# Altium project Soldering station finalise.PrjPcb
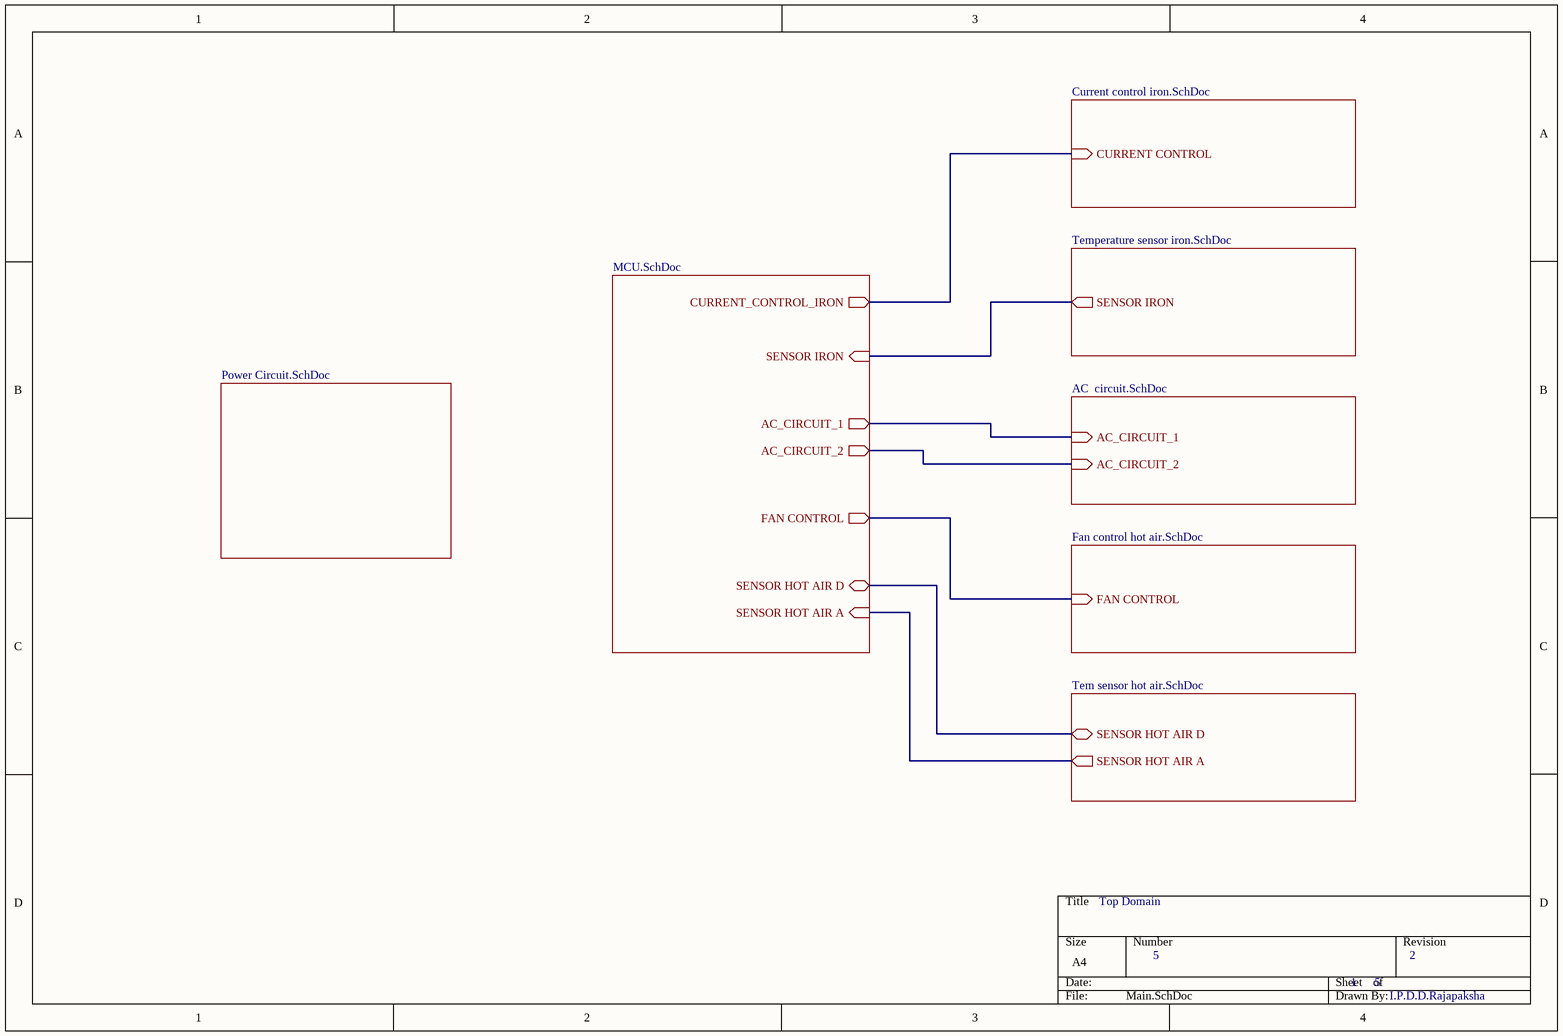
[diagram p0: Main.SchDoc]
8 sheets, 60 parts. Net scope: hierarchical (ports join the sheet entries above them; power ports are global).
Board file: DC_PCB.PcbDoc
Sheets:
  Main.SchDoc
    MCU = MCU.SchDoc
    Power Circuit = Power Circuit.SchDoc
    Current control iron = Current control iron.SchDoc
    Temperature sensor = Temperature sensor iron.SchDoc
    AC circuit = AC  circuit.SchDoc
    Fan control hot air = Fan control hot air.SchDoc
    Tem sensor hot air = Tem sensor hot air.SchDoc

## Sheet Main.SchDoc
size A4; SheetNumber: 1; SheetTotal: 8

### Sub-sheets
AC circuit = AC  circuit.SchDoc: AC_CIRCUIT_1 (in), AC_CIRCUIT_2 (in)
Current control iron = Current control iron.SchDoc: CURRENT CONTROL (in)
Fan control hot air = Fan control hot air.SchDoc: FAN CONTROL (in)
MCU = MCU.SchDoc: CURRENT_CONTROL_IRON (out), SENSOR IRON (in), FAN CONTROL (out), SENSOR HOT AIR A (in), SENSOR HOT AIR D (bidir), AC_CIRCUIT_1 (out), AC_CIRCUIT_2 (out)
Power Circuit = Power Circuit.SchDoc: no entries
Tem sensor hot air = Tem sensor hot air.SchDoc: SENSOR HOT AIR D (bidir), SENSOR HOT AIR A (out)
Temperature sensor = Temperature sensor iron.SchDoc: SENSOR IRON (out)

### Nets
NetC10_1: sheet MCU/SENSOR HOT AIR D, sheet Tem sensor hot air/SENSOR HOT AIR D
NetIC2_1: sheet MCU/SENSOR IRON, sheet Temperature sensor/SENSOR IRON
NetJ12_1: sheet MCU/AC_CIRCUIT_1, sheet AC circuit/AC_CIRCUIT_1
NetR2_2: sheet MCU/CURRENT_CONTROL_IRON, sheet Current control iron/CURRENT CONTROL
NetR8_1: sheet MCU/AC_CIRCUIT_2, sheet AC circuit/AC_CIRCUIT_2
NetR9_1: sheet MCU/FAN CONTROL, sheet Fan control hot air/FAN CONTROL
NetR15_1: sheet MCU/SENSOR HOT AIR A, sheet Tem sensor hot air/SENSOR HOT AIR A

### Notes on the sheet
- Top Domain
- 5
- 1      5
- 2
- I.P.D.D.Rajapaksha

## Sheet MCU.SchDoc
size A4; SheetNumber: 2; SheetTotal: 8
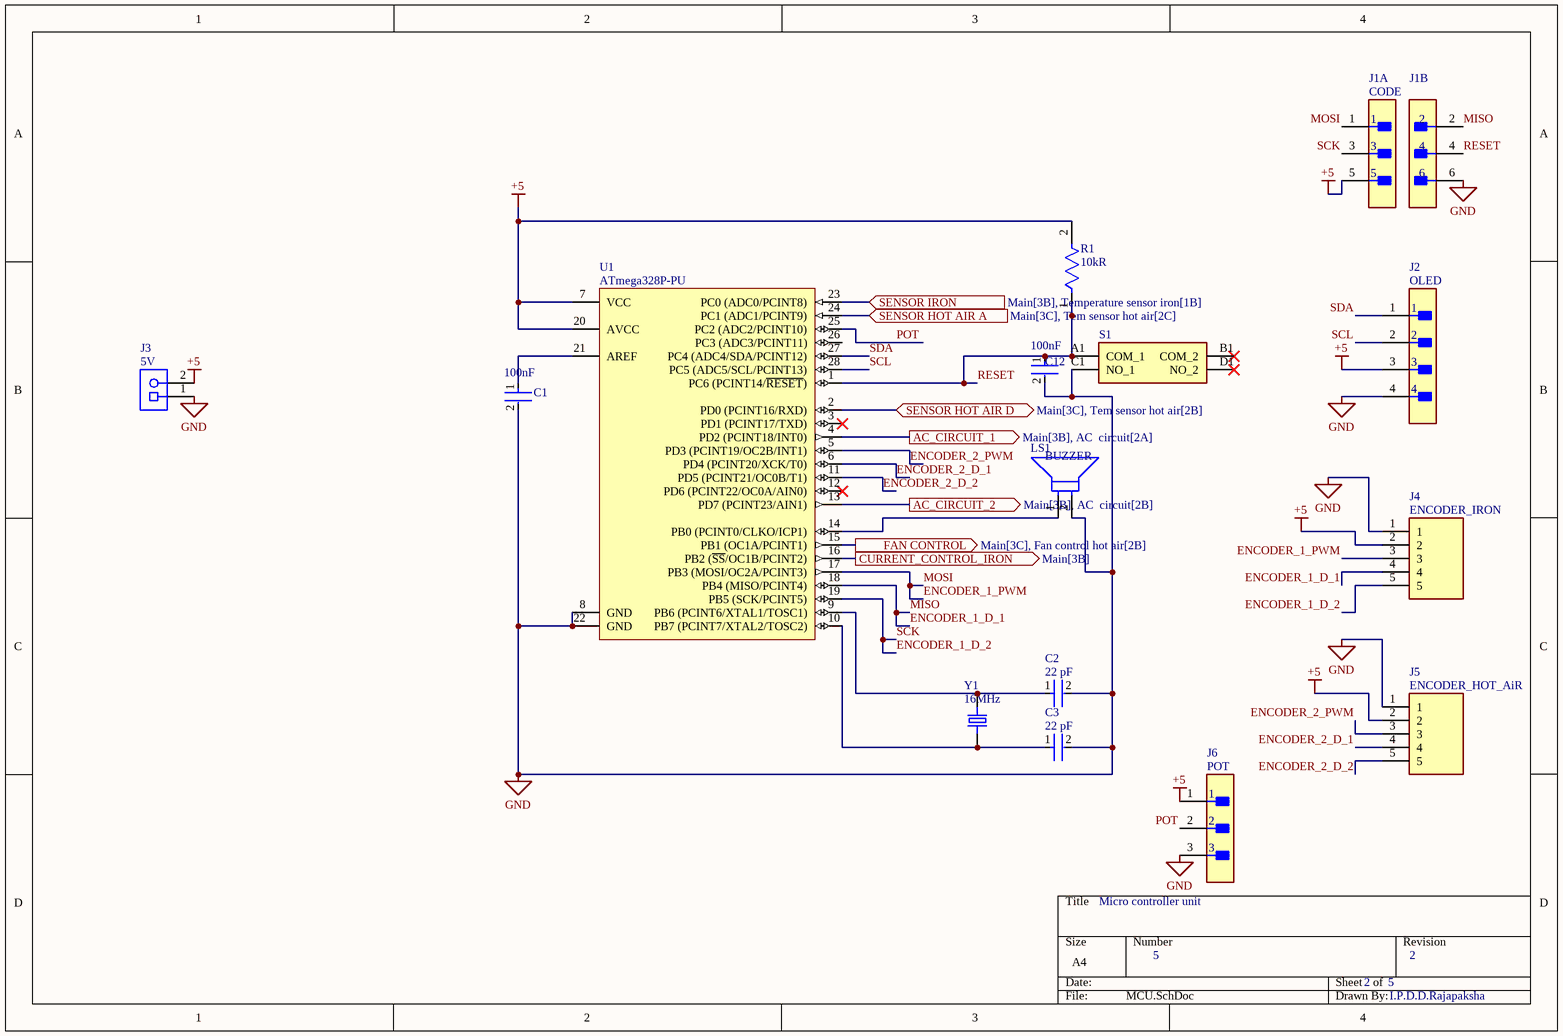
[diagram p1: MCU.SchDoc]

### Parts
C1  Capacitance: 100nF  [FP-0805-L_2_01_0_2-W_1_25-IPC_A]  (hidden comment: 0805YC104M4T2A)
C2  Capacitance: 22 pF  [FP-C0805C-DN-MFG]  (hidden comment: C0805C220J5GACTU)
C3  Capacitance: 22 pF  [FP-C0805C-DN-MFG]  (hidden comment: C0805C220J5GACTU)
C12  Capacitance: 100nF  [FP-0805-L_2_01_0_2-W_1_25-IPC_A]  (hidden comment: 0805YC104M4T2A)
J1  Parameter 1: CODE  [FP-90131-0763-MFG]  (hidden comment: 90131-0763)  (parts A,B of 2)
J2  value OLED  [FP-B4B-XH-A_LF_SN-MFG]  (hidden comment: B4B-XH-A(LF)(SN))
J3  Parameter 1: 5V  [PHOE-1729128-2_V]  (hidden comment: 1729128)
J4  Parameter 1: ENCODER_IRON  [B5BXHAMLFSN]  (hidden comment: B5B-XH-AM__LF__SN_)
J5  Parameter 1: ENCODER_HOT_AiR  [B5BXHAMLFSN]  (hidden comment: B5B-XH-AM__LF__SN_)
J6  Parameter 1: POT  [FP-B3B-XH-A_LF_SN-MFG]  (hidden comment: B3B-XH-A(LF)(SN))
LS1  Parameter 1: BUZZER  [FP-AI-1223-TWT-5V-R-MFG]  (hidden comment: AI-1223-TWT-5V-R)
R1  Resistance: 10kR  [FP-CRCW1206-e3-IPC_C]  (hidden comment: CRCW120610K0FKEA)
S1  TS-1187A-B-A-B  [TS1187ABAB]  (value not drawn)
U1  ATmega328P-PU  [28P3]
Y1  value 16MHz  [XTAL_ECS-160-20-4X]  (hidden comment: ECS-160-S-4)

### Ports
AC_CIRCUIT_1 (out, see Main[3B], AC  circuit[2A]), AC_CIRCUIT_2 (out, see Main[3B], AC  circuit[2B]), CURRENT_CONTROL_IRON (out, see Main[3B]), FAN CONTROL (out, see Main[3C], Fan control hot air[2B]), SENSOR HOT AIR A (in, see Main[3C], Tem sensor hot air[2C]), SENSOR HOT AIR D (bidir, see Main[3C], Tem sensor hot air[2B]), SENSOR IRON (in, see Main[3B], Temperature sensor iron[1B])

### Nets
+5: J1.5 J2.3 J3.2 J4.2 J5.2 J6.1 R1.2 U1.7(VCC) U1.20(AVCC)
GND: C1.2 C2.2 C3.2 C12.2 J1.6 J2.4 J3.1 J4.1 J5.1 J6.3 LS1.2(A) S1.C1(NO_1) U1.8(GND) U1.22(GND)  [project net negative]
ENCODER_1_D_1: J1.2 J4.4 U1.18(PB4_(MISO/PCINT4))  [also labelled MISO]
ENCODER_1_D_2: J1.3 J4.5 U1.19(PB5_(SCK/PCINT5))  [also labelled SCK]
ENCODER_1_PWM: J1.1 J4.3 U1.17(PB3_(MOSI/OC2A/PCINT3))  [also labelled MOSI]
ENCODER_2_D_1: J5.4 U1.6(PD4_(PCINT20/XCK/T0))
ENCODER_2_D_2: J5.5 U1.11(PD5_(PCINT21/OC0B/T1))
ENCODER_2_PWM: J5.3 U1.5(PD3_(PCINT19/OC2B/INT1))
POT: J6.2 U1.25(PC2_(ADC2/PCINT10))
RESET: C12.1 J1.4 R1.1 S1.A1(COM_1) U1.1(PC6_(PCINT14/~{RESET}))
SCL: J2.2 U1.28(PC5_(ADC5/SCL/PCINT13))
SDA: J2.1 U1.27(PC4_(ADC4/SDA/PCINT12))
NetC1_1: C1.1 U1.21(AREF)
NetC2_1: C2.1 U1.9(PB6_(PCINT6/XTAL1/TOSC1)) Y1.2
NetC3_1: C3.1 U1.10(PB7_(PCINT7/XTAL2/TOSC2)) Y1.1
NetC10_1: U1.2(PD0_(PCINT16/RXD)) ; port SENSOR HOT AIR D
NetIC2_1: U1.23(PC0_(ADC0/PCINT8)) ; port SENSOR IRON
NetJ12_1: U1.4(PD2_(PCINT18/INT0)) ; port AC_CIRCUIT_1
NetLS1_1: LS1.1(C) U1.14(PB0_(PCINT0/CLKO/ICP1))
NetR2_2: U1.16(PB2_(~{SS}/OC1B/PCINT2)) ; port CURRENT_CONTROL_IRON
NetR8_1: U1.13(PD7_(PCINT23/AIN1)) ; port AC_CIRCUIT_2
NetR9_1: U1.15(PB1_(OC1A/PCINT1)) ; port FAN CONTROL
NetR15_1: U1.24(PC1_(ADC1/PCINT9)) ; port SENSOR HOT AIR A

Not connected (* = marked no-connect by the designer): S1 B1(COM_2)* D1(NO_2)*; U1 3(PD1_(PCINT17/TXD))* 12(PD6_(PCINT22/OC0A/AIN0))* 26(PC3_(ADC3/PCINT11))

### Notes on the sheet
- (near J6) Micro controller unit
- 5
- 2      5
- 2
- I.P.D.D.Rajapaksha

### Library data of the parts
C1 C12 = CMP-04427-015812-1: Automotive Ceramic Capacitor, 0805, 100nF, 20%, X7R, 0.15, 16V; Termination: SMD/SMT; Case Code (Metric): 2012; Length: 0.079inch; Dielectric: X7R; Max Operating Temperature: 125°C; Thickness: 0.037inch; Ratings: AEC-Q200; Package Quantity: 4000; Weight: 0.000194oz; Voltage Rating: 16V; Voltage Rating (DC): 16V; Mount: Surface Mount; Width: 1.25mm; Packaging: Tape and Reel; Tolerance: 20%; Case/Package: 0805; Height: 0.94mm; Case Code (Imperial): 0805; Min Operating Temperature: -55°C
C2 C3 = CMP-2007-00048-2: Capacitor; Ceramic; Cap; 22.0pF; Tol 5%; SMT; Vol-Rtg 50V; C0G; Tape and Reel; Manufacturer: KEMET; Temperature Coefficient: 30ppm/°C; Value: 22 pF; Tolerance: 0.05; Device Class L1: Passive Components; Mouser Description: Multilayer Ceramic Capacitors MLCC - SMD/SMT 50volts 22pF C0G 5%; Temperature Range Low: -55°C; Automotive: No; Voltage Rating: 50 V; Material: Ceramic; Category: Cap; Height: 0.88mm; Temperature Range High: +125°C; Digikey Description: Capacitor; Ceramic; Cap; 22.0pF; Tol 5%; SMT; Vol-Rtg 50V; C0G; Tape and Reel; Octopart: https://octopart.com/c0805c220j5gactu-kemet-145470; ComponentLink2Description: Datasheet; Device Class L2: Capacitors; Ipc Land Pattern Name: CAPC200125X78; RoHS: TRUE; ComponentLink2URL: https://content.kemet.com/datasheets/KEM_C1003_C0G_SMD.pdf; Temperature: -55°C to +125°C; Device Class L3: Ceramic Capacitors; Lead Free: Yes; Manufacturer Part Number: C0805C220J5GACTU; Temperature Characteristic: C0G; Package: C0805C-DN
J1 = CMP-00257-00655468-1: 90131-0763 Conn Unshrouded Header HDR 6 POS 2.54mm Solder ST Top Entry Thru-Hole C-Grid III™ Tray; NexarPartId: 655468; Manufacturer Lifecycle Status: ACTIVE; Number of Poles: 6; Plating: Tin; Current Rating: 3A; Gender: Male; Voltage Rating (AC): 350V; Contact Resistance: 20mΩ; Insulation Resistance: 5GΩ; Pitch: 2.54mm; Height: 9.65mm; Mount: Through Hole; Termination: Through Hole; Contact Plating: Gold; Orientation: Vertical; Material: Glass, Polyester; Min Operating Temperature: -55°C; Lead Free: Lead Free; REACH SVHC: Unknown; Contact Material: Brass; Housing Color: Black; Schedule B: 8536694040; Number of Rows: 2; Lead Pitch: 2.54mm; Number of Circuits: 6; Number of Positions: 6; Lifecycle Status: Production; Max Operating Temperature: 125°C; Voltage Rating: 350V; Voltage Rating (DC): 350V; Country of Origin: SG; Housing Material: Polyester; RoHS: Compliant; Working Voltage: 350V; Number of Contacts: 6; Radiation Hardening: No
J2 = CMP-17439-000250-1: CONN HEADER VERT 4POS 2.5MM; Number of Contacts: 4; Contact Resistance: 20mR; Voltage Rating: 250V; Max Current Rating: 3A; Gender: Male; Wire/Cable Gauge: 22AWG; Mated Stacking Heights: 9.8mm; Insulation Resistance: 1GR; Orientation: Straight; Contact Type: Male Pin; Contact Finish - Mating: TIN; Series: XH; Max Voltage Rating (AC): 250V; Lead Pitch: 2.5mm; Contact Shape: Square; Insulation Color: Natural; Termination: Solder; Lead Free: Lead Free; Voltage Rating (AC): 250V; Number of Rows: 1; Flammability Rating: UL94 V-0; Number of Positions: 4; Max Operating Temperature: 85°C; Package Quantity: 500; Mount: Through Hole; REACH SVHC: No SVHC; Connector Type: Header; Insulation Material: Nylon; Fastening Type: Detent; Min Operating Temperature: -25°C; Housing Color: White; Packaging: Bulk; Contact Plating: Tin; Contact Material: Brass; Max Voltage Rating (DC): 250V; Housing Material: Polyamide; Color: Natural; Material: Polyamide; Pitch: 2.5mm; Depth: 5.75mm; Current Rating: 3A; Length: 12.4mm
J3 = CMP-2000-05815-1: PCB Terminal Block, 13.5 A, 400 V, 2-Pin THD, RoHS, Bulk; Manufacturer: Phoenix Contact; Package Version: 03/2015; No. of Rows: 1; Pitch: 5.08mm; No. of Positions: 2; Voltage Rating: 400V; Current Rating: 13500mA; Manufacturer URL: http://www.phoenixcontact.com/; Datasheet URL: https://datasheet.ciiva.com/16046/1729128-16046181.pdf; RoHS: TRUE; Package URL: https://www.phoenixcontact.com/online/portal/pi/pxc/product_detail_page/!ut/p/b1/3VdJjqNKFDxLH8AFycySyWY2ozFsEPOMMQaDOX1XedGL_1Vdm5YXJleknhSKeBkvI6EA8ncAo3AYoDhBQGco6KN7VURTdemj9us_IEKEZo_YHiPAEWEFmDGOHMORkqKYCORBZxgL7ZoaZYcbFFUZ3fqxSY6GOuxydWUuHqz1ynmMFygu583Bob0Ewr6Sd_l-5m-kAueHiB0jpRwZwe58wwtkpxtMYd_LmGcDRU02dRNEyWt6Y2ti5pSyJ_reIkzIulrqApdnbT11V5jnCKbYNCvhEM1MCpPByat_X379-iThf08CI5GfOPqfBeS3BRoBOdD55AKVv0iLwCMq-2BrzXWSGRH7pUGD9uwXQjiph3xL0DKQwdGa0JImiIOmBNOestqgwTHSSs2oOep-78apyXQBvNi8ZLaFjvjWvcaUEBu0MC6Wbe-d6mB0FAebo2lUWinqYaZs5DAYzV0RP9yitUjnGJ0iI9xhZkT42OCQNUJJhkgWINNQLP2JFP6OpMg3JCVg70jqHT0lvKOnhHf0lPuOnnLf0VPuWx6_dxwUIvwk5WMkT0kLL1mh61l2yZVSzG3pYV_bqo-mj6uMKwKwdnnW8Jh5RTOJzMOA5c-eJDaZQw4mTMPH02PvS_ZAqNVjVTo2WyYLkwH_KU1mmmG5kjRhDqPXLwwVHvVOjCM60-fpXvTDfMGW1PVFVS1r4e4yVDk4ZdNbkUHvqPqQSeian4UD39fNKmachqdJ1NJbyk8rXT9mXTvPk3oE5meulKGgiruPJek-4I9hTT6G8ZLOyRSm2RRVbThERQad5OS28hdt4YW4vG0stgYYzsWsK4_7y6DZMjJSCqri1kyiZR5vD7pwIrNR7QwPHTcLTI5qT7eRlpHrdGiupYlqQDJ7zy_CND8fWWBoLRXxk1RVcXiBQwbTD4Xi7KL-FuO94t9xaqweXzH; PartNumber: 1729128; Package Description: 2-Pin Through Hole Device, Body 8.1 x 10.16 mm, Pitch 5.08 mm; Datasheet Version: 12/2013; Mounting Technology: ThroughHole; Orientation: Horizontal; Package Reference: 1729128-2; Packing: Bulk
J4 J5 = B5B-XH-AM__LF__SN_: Connector; Manufacturer_Name: JST (JAPAN SOLDERLESS TERMINALS); Manufacturer_Part_Number: B5B-XH-AM (LF)(SN); Datasheet Link: http://uk.rs-online.com/web/p/products/1755317; Height: 7mm; Arrow Part Number: B5B-XH-AM (LF)(SN); Arrow Price/Stock: https://www.arrow.com/en/products/b5b-xh-am-lf-sn/jst-manufacturing
J6 = CMP-17439-000014-3: CONN HEADER VERT 3POS 2.5MM; Max Voltage Rating (DC): 250V; Number of Positions: 3; Current Rating: 3A; Gender: Male; Wire/Cable Gauge: 22AWG; Contact Resistance: 20mR; Insulation Resistance: 1GR; Insulation Material: Nylon; Contact Plating: Tin; Depth: 5.75mm; Contact Type: Male Pin; Max Operating Temperature: 85°C; Insulation Color: Natural; Voltage Rating (AC): 250V; Color: Natural; Connector Type: Header; Orientation: Straight; Fastening Type: Detent; Housing Color: White; Min Operating Temperature: -25°C; Termination: Solder; Voltage Rating: 250V; Series: XH; Pitch: 2.5mm; Contact Shape: Square; Number of Rows: 1; Lead Free: Lead Free; Packaging: Bulk; Mount: Through Hole; Flammability Rating: UL94 V-0; Max Voltage Rating (AC): 250V; REACH SVHC: No SVHC; Housing Material: Polyamide; Contact Material: Brass; Lead Pitch: 2.5mm; Contact Finish - Mating: TIN; Length: 9.9mm; Max Current Rating: 3A; Number of Contacts: 3
LS1 = CMP-231724-000001-1: AUDIO MAGNETIC INDICATOR 3-7V TH; Input Type: DC; Bandwidth: 2.3kHz; Nominal Supply Voltage (DC): 5V; Max Supply Current: 30mA; Washable: Yes; Max Supply Voltage (DC): 7V; Min Supply Voltage: 3V; Series: AI; Width: 12mm; REACH SVHC: No SVHC; Contact Plating: Tin; Frequency: 2.3kHz; Operating Supply Current: 30mA; Weight: 0.01lb; Current Rating: 30mA; Mount: Through Hole; Packaging: Tray; Length: 12mm; Lead Free: Lead Free; Color: Black; Input Current: 30mA; Min Operating Temperature: -40°C; Self Resonant Frequency: 2.3kHz; Sensing Method: Magnetic; Voltage Rating (DC): 5V; Height: 9.5mm; Termination: PC Pins; Min Supply Voltage (DC): 3V; Package Quantity: 100; Max Supply Voltage: 7V; Diameter: 12mm; Max Operating Temperature: 85°C
R1 = CMP-2003-04807-2: RES Thick Film, 10kΩ, 1%, 0.25W, 100ppm/°C, 1206; Working Voltage: 200V; Max Power Dissipation: 250mW; Tolerance: 1%; Width: 0.063inch; Height: 0.55mm; Number of Pins: 2; Voltage Rating: 200V; Temperature Coefficient: 100ppm/°C; Military Standard: Not; Features: Automotive AEC-Q200; Depth: 1.6mm; Radiation Hardening: No; Termination: SMD/SMT; Case Code (Imperial): 1206; Weight: 0.000353oz; Length: 3.2mm; Package Quantity: 10; Voltage Rating (DC): 200V; Case/Package: 1206; Min Operating Temperature: -55°C; Number of Terminations: 2; Composition: Thick Film; Contact Plating: Tin; Power Rating: 250mW; Packaging: Tape and Reel; Max Operating Temperature: 155°C; Lead Free: Lead Free; Case Code (Metric): 3216
S1 = TS-1187A-B-A-B: Switch; Manufacturer_Name: XKB Connectivity; Datasheet Link: http://www.helloxkb.com/public/images/pdf/TS-1187A-X-X-X.pdf; Height: 4.05mm; Manufacturer_Part_Number: TS-1187A-B-A-B
U1 = CMP-0095-00013-2: 8-bit AVR Microcontroller, 32KB Flash, 1KB EEPROM, 2KB SRAM, 28-pin PDIP, Industrial Grade (-40°C to 85°C); RevisionNote: DatasheetVersion updated. URLs added.; PackageVersion: revB, Sep-2001; PackageDescription: 28-lead (0.300"/7.62mm Wide) Plastic Dual Inline Package (PDIP); DatasheetVersion: revD, May-2011; ComponentLink1Description: Manufacturer URL; ComponentLink1URL: http://www.atmel.com/; PackageReference: 28P3; ComponentLink2Description: ATmega48A/48PA/88A/88PA/168A/168PA/328/328P Datasheet; ComponentLink3URL: http://www.atmel.com/dyn/resources/prod_documents/8271S.pdf; ComponentLink2URL: http://www.atmel.com/dyn/resources/prod_documents/8271.pdf; ComponentLink3Description: ATmega48A/48PA/88A/88PA/168A/168PA/328/328P Summary
Y1 = ECS-160-S-4: 16MHz Â±30ppm Crystal Series 40 Ohms HC-49/US; MF: ECS Inc.; SnapEDA_Link: https://www.snapeda.com/parts/ECS-160-S-4/ECS%20Inc./view-part/3657575/?ref=snap; Availability: Unavailable; Price: None; MP: ECS-160-S-4; Package: HC49/US ECS International

## Sheet Power Circuit.SchDoc
size A4; SheetNumber: 3; SheetTotal: 8
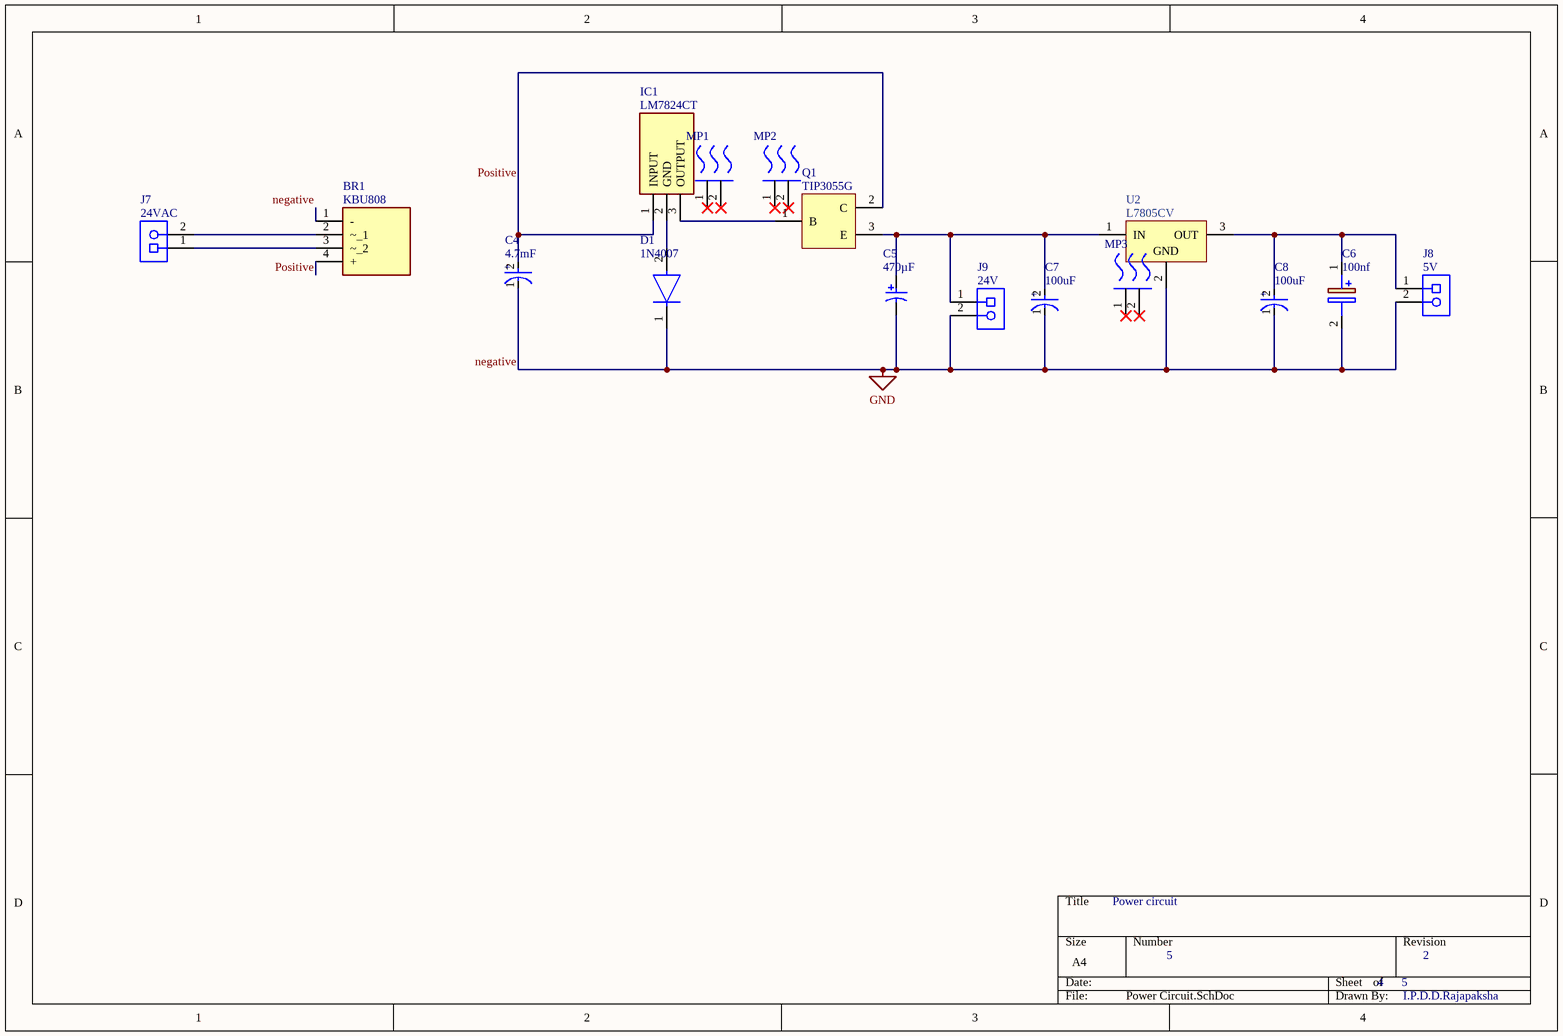
[diagram p2: Power Circuit.SchDoc]

### Parts
BR1  KBU808  [KBU808]
C4  Capacitance: 4.7mF  [FP-RAD-TH-D_18_0_5-L_35_5-MFG]  (hidden comment: ECA1VHG472)
C5  Capacitance: 470µF  [PNSC-CAP-10x20-P2]  (hidden comment: ECA-1HHG471)
C6  Parameter 1: 100nf  [CAPPRD150W50D400H600]  (hidden comment: ECEA1HKS0R1)
C7  Capacitance: 100uF  [FP-EEU-FR1H101B-MFG]  (hidden comment: EEU-FR1H101B)
C8  Capacitance: 100uF  [FP-EEU-FR1H101B-MFG]  (hidden comment: EEU-FR1H101B)
D1  1N4007  [FP-1N4007-MFG]
IC1  LM7824CT  [TO254P470X1028X1955-3P]
J7  Parameter 1: 24VAC  [PHOE-1729128-2_V]  (hidden comment: 1729128)
J8  Parameter 1: 5V  [PHOE-1729128-2_V]  (hidden comment: 1729128)
J9  Parameter 1: 24V  [PHOE-1729128-2_V]  (hidden comment: 1729128)
MP1  WV-T264-101E  [FP-WV-T264-101E-MFG]  (value not drawn)
MP2  WV-T264-101E  [FP-WV-T264-101E-MFG]  (value not drawn)
MP3  WV-T264-101E  [FP-WV-T264-101E-MFG]  (value not drawn)
Q1  TIP3055G  [ONSC-TO-247-3-340L-02]
U2  L7805CV  [TO220]

### Nets
negative: BR1.1(-) C4.1(C) C5.2 C6.2(-) C7.1(C) C8.1(C) D1.1(C) J8.2 J9.2 U2.2(GND)  [also labelled GND]
Positive: BR1.4(+) C4.2(A) IC1.1(INPUT) Q1.2(C)
NetBR1_2: BR1.2(~_1) J7.2
NetBR1_3: BR1.3(~_2) J7.1
NetC5_1: C5.1 C7.2(A) J9.1 Q1.3(E) U2.1(IN)
NetC6_1: C6.1(+) C8.2(A) J8.1 U2.3(OUT)
NetD1_2: D1.2(A) IC1.2(GND)
NetIC1_3: IC1.3(OUTPUT) Q1.1(B)

Not connected (* = marked no-connect by the designer): MP1 1(MNT_1)* 2(MNT_2)*; MP2 1(MNT_1)* 2(MNT_2)*; MP3 1(MNT_1)* 2(MNT_2)*

### Notes on the sheet
- Power circuit
- 5
- 4      5
- 2
- I.P.D.D.Rajapaksha
- (in symbol CMP-05427-000020-1) +
- (in symbol CMP-05427-001627-1) +

### Library data of the parts
BR1 = KBU808: Bridge Rectifier; Manufacturer_Name: MDD; Datasheet Link: https://datasheet.lcsc.com/szlcsc/MDD-Jiangsu-Yutai-Elec-KBU808_C3087.pdf; Height: 19.8mm; Manufacturer_Part_Number: KBU808
C4 = CMP-05427-001627-1: Aluminum Electrolytic Capacitors (Radial Lead Type) AEC-Q200 Qualified 4700uF ±20% 35V; Leakage Current: 3uA; Life (Hours): 2000Hour; Lead Diameter: 0.8mm; Dissipation Factor: 0.2%; Lead/Base Style: Straight; Ripple Current: 1.91A; Packaging: Bulk; RoHS Compliant: Yes; Number of Pins: 2; Radiation Hardening: No; Features: General Purpose; Mount: Through Hole; Voltage Rating (DC): 35V; Construction: RADIAL; Min Operating Temperature: -55°C; Voltage Rating: 35V; Contact Plating: Tin; Height - Seated (Max): 1.398inch; Termination: Radial; Series: NHG; Lead Pitch: 7.5mm; Diameter: 18mm; Voltage: 35V; Package Quantity: 50; Height: 35.5mm; Max Operating Temperature: 105°C; REACH SVHC: No SVHC; Length: 35.5mm; Case/Package: Radial; Tolerance: 20%; Ripple Current (AC): 1.91A
C5 = CMP-2000-05308-1: Aluminum Electrolytic Capacitor, 470 uF, +/- 20%, 50 V, -55 to 105 degC, 2-Pin THD, RoHS, Bulk; Manufacturer: Panasonic; Package Version: Nov-12; Type: Radial; Lifetime@Temperature: 2000Hrs@105degC; Rated Voltage: 50V; Ripple Current: 530mA; Case Size/Dimension: Ø10x20mm; Package Reference: CAP-10x20-P2; Package Description: 2-Pin Through Hole Device, Dia 10 mm, Body Length 20 mm, Pin Spacing 5 mm; Series: NHG; Datasheet Version: Nov-12; Datasheet URL: http://www.alliedelec.com/images/products/datasheets/bm/Panasonic/70067776.pdf; Package URL: http://www.alliedelec.com/images/products/datasheets/bm/Panasonic/70067776.pdf; Operating Temp-Max: 105degC; Operating Temp Range: -55to+105degC; Manufacturer URL: http://www.panasonic.com/
C6 = ECEA1HKS0R1: Capacitor Polarised; Manufacturer_Name: Panasonic; Datasheet Link: https://componentsearchengine.com/Datasheets/2/ECEA1HKS0R1.pdf; Height: 6mm; Manufacturer_Part_Number: ECEA1HKS0R1
C7 C8 = CMP-05427-000020-1: CAP ALUM 100UF 20% 50V RADIAL; Life (Hours): 6000Hour; Ripple Current: 870mA; Lead Diameter: 0.6mm; Impedance: 61mR; Tolerance: 20%; Mount: Through Hole; Lead Free: Lead Free; Length: 11.5mm; Height - Seated (Max): 0.512inch; Contact Plating: Tin; Termination: Radial; Series: FR; Max Operating Temperature: 105°C; Features: General Purpose; Min Operating Temperature: -40°C; RoHS Compliant: Yes; Height: 11.5mm; Voltage Rating (DC): 50V; Diameter: 8mm; Lead Pitch: 5mm; Radiation Hardening: No; Package Quantity: 1; Case/Package: Radial; Voltage Rating: 50V; Packaging: Tape and Reel; ESR (Equivalent Series Resistance): 61mR; REACH SVHC: No SVHC
D1 = CMP-123542-000001-1: Rectifier diode 1000 V 1 A DO-41, ,; Manufacturer: Diotec; Max Surge Forward Current: 27A; Forward Current: 1A; Max Junction Temp: +175°C; Reverse Voltage: 1000V; Value: 15pF; Peak Reverse Current: 5uA; Category: Diode; Temperature Range Low: -50°C; Automotive: No; Temperature: -50°C to +175°C; Lead Free: Yes; ComponentLink2Description: Datasheet; Max Repetitive Reverse Voltage: 1000V; ComponentLink2URL: https://datasheet.octopart.com/1N4007-Diotec-datasheet-62346875.pdf; Manufacturer Part Number: 1N4007; Device Class L3: Rectifier Diodes; Height: 2.8mm; Octopart: https://octopart.com/1n4007-diotec-4040411; Package: 1N4007; Temperature Range High: +175°C; Device Class L1: Discrete Semiconductors; Device Class L2: Diodes; RoHS: TRUE; Capacitance: 15pF; Ipc Land Pattern Name: DIOAD888W100L520D280
IC1 = LM7824CT: Integrated Circuit; Manufacturer_Name: Texas Instruments; Datasheet Link: https://media.digikey.com/pdf/Data%20Sheets/National%20Semiconductor%20PDFs/LM140,LM340(A).LM7800C.pdf; Height: 4.7mm; Manufacturer_Part_Number: LM7824CT; Mouser Part Number: N/A; Mouser Price/Stock: https://www.mouser.co.uk/ProductDetail/Texas-Instruments/LM7824CT?qs=9V2QonpqdTsSUSVcEBRo9w%3D%3D
J7-J9 = CMP-2000-05815-1: as J3 on sheet MCU; Manufacturer URL: http://www.phoenixcontact.com/; Datasheet URL: https://datasheet.ciiva.com/16046/1729128-16046181.pdf; RoHS: TRUE; Package URL: https://www.phoenixcontact.com/online/portal/pi/pxc/product_detail_page/!ut/p/b1/3VdJjqNKFDxLH8AFycySyWY2ozFsEPOMMQaDOX1XedGL_1Vdm5YXJleknhSKeBkvI6EA8ncAo3AYoDhBQGco6KN7VURTdemj9us_IEKEZo_YHiPAEWEFmDGOHMORkqKYCORBZxgL7ZoaZYcbFFUZ3fqxSY6GOuxydWUuHqz1ynmMFygu583Bob0Ewr6Sd_l-5m-kAueHiB0jpRwZwe58wwtkpxtMYd_LmGcDRU02dRNEyWt6Y2ti5pSyJ_reIkzIulrqApdnbT11V5jnCKbYNCvhEM1MCpPByat_X379-iThf08CI5GfOPqfBeS3BRoBOdD55AKVv0iLwCMq-2BrzXWSGRH7pUGD9uwXQjiph3xL0DKQwdGa0JImiIOmBNOestqgwTHSSs2oOep-78apyXQBvNi8ZLaFjvjWvcaUEBu0MC6Wbe-d6mB0FAebo2lUWinqYaZs5DAYzV0RP9yitUjnGJ0iI9xhZkT42OCQNUJJhkgWINNQLP2JFP6OpMg3JCVg70jqHT0lvKOnhHf0lPuOnnLf0VPuWx6_dxwUIvwk5WMkT0kLL1mh61l2yZVSzG3pYV_bqo-mj6uMKwKwdnnW8Jh5RTOJzMOA5c-eJDaZQw4mTMPH02PvS_ZAqNVjVTo2WyYLkwH_KU1mmmG5kjRhDqPXLwwVHvVOjCM60-fpXvTDfMGW1PVFVS1r4e4yVDk4ZdNbkUHvqPqQSeian4UD39fNKmachqdJ1NJbyk8rXT9mXTvPk3oE5meulKGgiruPJek-4I9hTT6G8ZLOyRSm2RRVbThERQad5OS28hdt4YW4vG0stgYYzsWsK4_7y6DZMjJSCqri1kyiZR5vD7pwIrNR7QwPHTcLTI5qT7eRlpHrdGiupYlqQDJ7zy_CND8fWWBoLRXxk1RVcXiBQwbTD4Xi7KL-FuO94t9xaqweXzH; PartNumber: 1729128; Package Description: 2-Pin Through Hole Device, Body 8.1 x 10.16 mm, Pitch 5.08 mm; Datasheet Version: 12/2013; Mounting Technology: ThroughHole; Orientation: Horizontal; Package Reference: 1729128-2; Packing: Bulk
MP1-MP3 = CMP-33535-000032-1: HEATSINK W/CLIP FOR TO-264; Natural Thermal Resistance: 12°C/W; Shape: Fins; Thermal Resistance @ Forced Air Flow (100 LFM): 8°C/W; Width: 23.4mm; Weight: 0.42oz; Package Quantity: 10; RoHS Compliant: Yes; Mount: Clip; Package Cooled: TO-264; Height Off Base: 0.63inch; Height: 32mm; Packaging: Bulk; Series: W; Case/Package: TO-264; Length: 1.26inch; Material: Aluminium
Q1 = CMP-1048-01314-1: Complementary Silicon Power Transistor, 3-Pin TO-247, Pb-Free, Tube; Manufacturer: On Semiconductor; Polarity: NPN; fT Min (MHz): 2.5; IC Continuous (A): 15; ComponentLink3URL: http://www.onsemi.cn/pub_link/Collateral/340L-02.PDF; ComponentLink3Description: Package Specification; RoHS: TRUE; PackageDescription: 3-Pin Flange Mount, Vertical Straight Lead, Body 16.005 x 5 mm, Pitch 5.45 mm; PackageVersion: Rev. F, 10/2011; ComponentLink1Description: Manufacturer URL; PackageReference: TO-247-3-340L-02; DatasheetVersion: Rev. 7; ComponentLink2Description: Datasheet; Packing: Tube; Mounting Technology: Through Hole; ComponentLink1URL: http://www.onsemi.com/; ComponentLink2URL: http://www.onsemi.com/pub_link/Collateral/TIP3055-D.PDF; PartNumber: TIP3055G
U2 = CMP-0244-00483-1: Positive Voltage Regulator, 5V, 3-Pin TO-220; PackageDescription: TO, Thru-Hole, Vertical, Heatsink Mounted; 3 In-Line Leads; Pitch 2.54 mm; ComponentLink2Description: Datasheet; PackageReference: TO220; ComponentLink3URL: http://www.st.com/internet/com/TECHNICAL_RESOURCES/TECHNICAL_LITERATURE/PACKAGE_INFORMATION/CD00004649.pdf; DatasheetVersion: 16/11/2011; ComponentLink1Description: Manufacturer URL; ComponentLink1URL: http://www.st.com; PackageVersion: ver3.0; ComponentLink3Description: Package Specification; ComponentLink2URL: http://www.st.com/internet/com/TECHNICAL_RESOURCES/TECHNICAL_LITERATURE/DATASHEET/CD00000444.pdf

## Sheet Current control iron.SchDoc
size A4; SheetNumber: 4; SheetTotal: 8
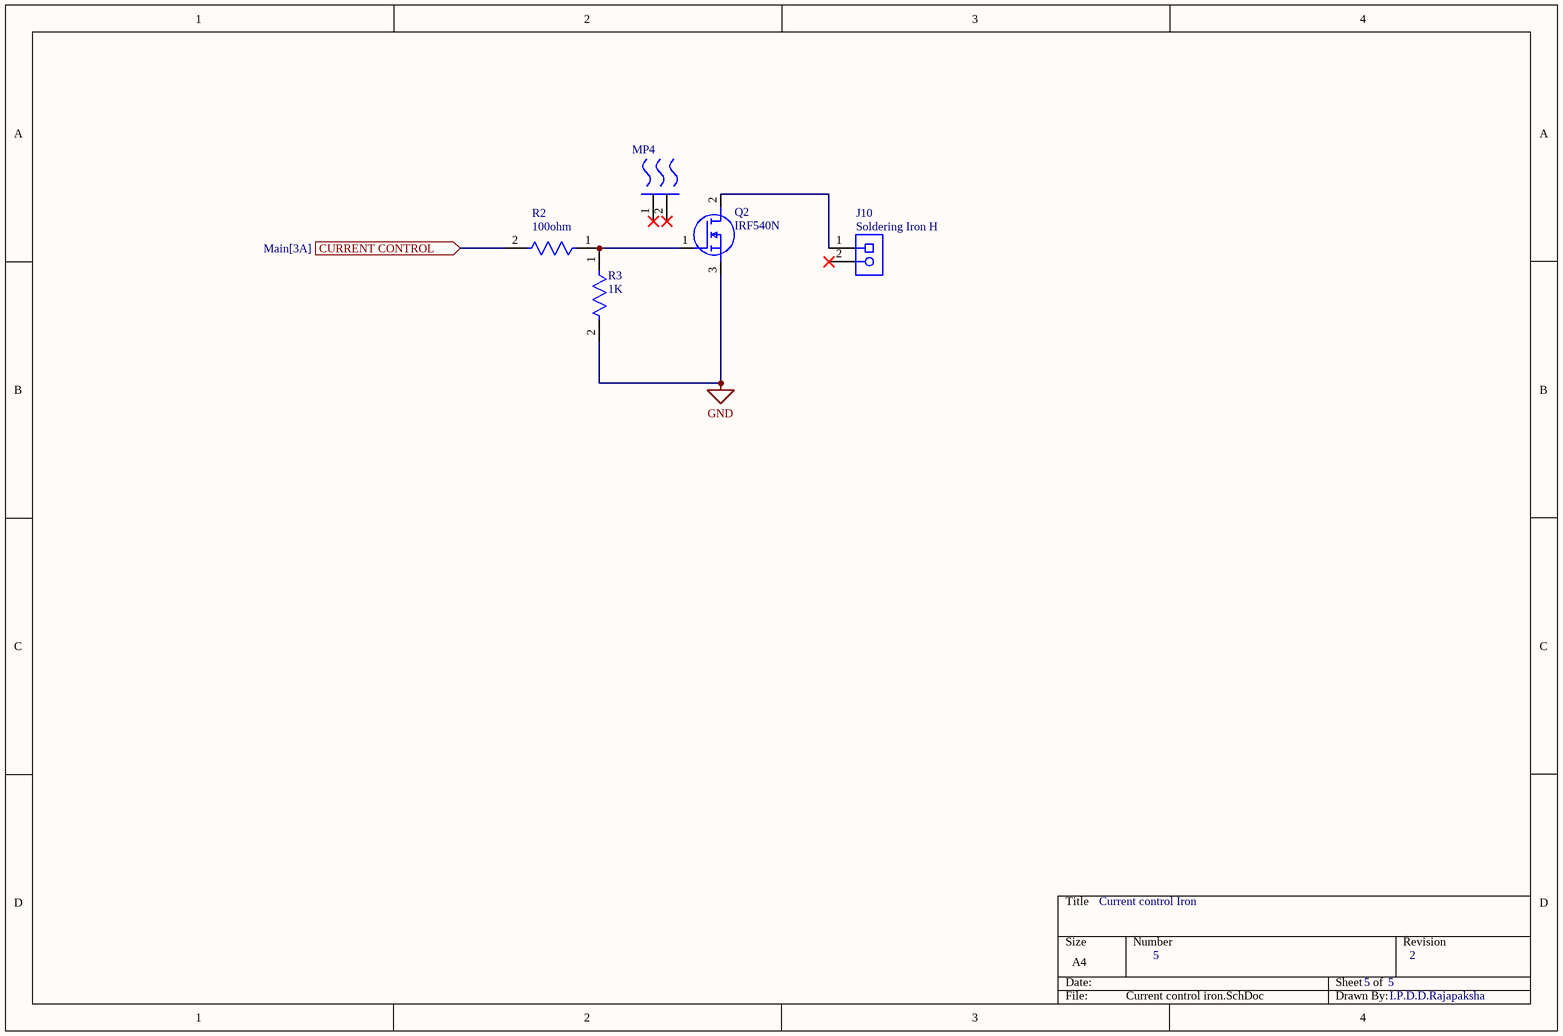
[diagram p3: Current control iron.SchDoc]

### Parts
J10  Parameter 1: Soldering Iron H  [PHOE-1729128-2_V]  (hidden comment: 1729128)
MP4  WV-T264-101E  [FP-WV-T264-101E-MFG]  (value not drawn)
Q2  IRF540N  [TO254P469X1042X1967-3P]
R2  value 100ohm  [FP-CMF50-0]  (hidden comment: CMF5073K200FHEB)
R3  value 1K  [FP-CMF50-0]  (hidden comment: CMF5073K200FHEB)

### Ports
CURRENT CONTROL (in, see Main[3A])

### Nets
GND: Q2.3(S) R3.2  [project net negative]
NetJ10_1: J10.1 Q2.2(D)
NetQ2_1: Q2.1(G) R2.1 R3.1
NetR2_2: R2.2 ; port CURRENT CONTROL

Not connected (* = marked no-connect by the designer): J10 2*; MP4 1(MNT_1)* 2(MNT_2)*

### Notes on the sheet
- Current control Iron
- 5
- 5      5
- 2
- I.P.D.D.Rajapaksha

### Library data of the parts
J10 = CMP-2000-05815-1: as J3 on sheet MCU; Manufacturer URL: http://www.phoenixcontact.com/; Datasheet URL: https://datasheet.ciiva.com/16046/1729128-16046181.pdf; RoHS: TRUE; Package URL: https://www.phoenixcontact.com/online/portal/pi/pxc/product_detail_page/!ut/p/b1/3VdJjqNKFDxLH8AFycySyWY2ozFsEPOMMQaDOX1XedGL_1Vdm5YXJleknhSKeBkvI6EA8ncAo3AYoDhBQGco6KN7VURTdemj9us_IEKEZo_YHiPAEWEFmDGOHMORkqKYCORBZxgL7ZoaZYcbFFUZ3fqxSY6GOuxydWUuHqz1ynmMFygu583Bob0Ewr6Sd_l-5m-kAueHiB0jpRwZwe58wwtkpxtMYd_LmGcDRU02dRNEyWt6Y2ti5pSyJ_reIkzIulrqApdnbT11V5jnCKbYNCvhEM1MCpPByat_X379-iThf08CI5GfOPqfBeS3BRoBOdD55AKVv0iLwCMq-2BrzXWSGRH7pUGD9uwXQjiph3xL0DKQwdGa0JImiIOmBNOestqgwTHSSs2oOep-78apyXQBvNi8ZLaFjvjWvcaUEBu0MC6Wbe-d6mB0FAebo2lUWinqYaZs5DAYzV0RP9yitUjnGJ0iI9xhZkT42OCQNUJJhkgWINNQLP2JFP6OpMg3JCVg70jqHT0lvKOnhHf0lPuOnnLf0VPuWx6_dxwUIvwk5WMkT0kLL1mh61l2yZVSzG3pYV_bqo-mj6uMKwKwdnnW8Jh5RTOJzMOA5c-eJDaZQw4mTMPH02PvS_ZAqNVjVTo2WyYLkwH_KU1mmmG5kjRhDqPXLwwVHvVOjCM60-fpXvTDfMGW1PVFVS1r4e4yVDk4ZdNbkUHvqPqQSeian4UD39fNKmachqdJ1NJbyk8rXT9mXTvPk3oE5meulKGgiruPJek-4I9hTT6G8ZLOyRSm2RRVbThERQad5OS28hdt4YW4vG0stgYYzsWsK4_7y6DZMjJSCqri1kyiZR5vD7pwIrNR7QwPHTcLTI5qT7eRlpHrdGiupYlqQDJ7zy_CND8fWWBoLRXxk1RVcXiBQwbTD4Xi7KL-FuO94t9xaqweXzH; PartNumber: 1729128; Package Description: 2-Pin Through Hole Device, Body 8.1 x 10.16 mm, Pitch 5.08 mm; Datasheet Version: 12/2013; Mounting Technology: ThroughHole; Orientation: Horizontal; Package Reference: 1729128-2; Packing: Bulk
MP4 = CMP-33535-000032-1: as MP1 on sheet Power Circuit; Width: 23.4mm; Weight: 0.42oz; Package Quantity: 10; RoHS Compliant: Yes; Mount: Clip; Package Cooled: TO-264; Height Off Base: 0.63inch; Height: 32mm; Packaging: Bulk; Series: W; Case/Package: TO-264; Length: 1.26inch; Material: Aluminium
Q2 = IRF540N: MOSFET (N-Channel); Manufacturer_Name: Infineon; Datasheet Link: http://uk.rs-online.com/web/p/products/3713068; Height: 4.69mm; Manufacturer_Part_Number: IRF540N
R2 R3 = CMP-00030-44386654-1: CMF5073K200FHEB Res Metal Film 73.2K Ohm 1% 0.125W(1/8W) ±50ppm/°C Epoxy AXL T/R; Max Power Dissipation: 250mW; Voltage Rating: 200V; Power Rating: 125mW; Resistance: 73.2kΩ; Tolerance: 1%; Width: 1.65mm; Length: 3.81mm; Schedule B: 8533210090, 8533210090; Termination: Axial; Lead Free: Lead Free; Diameter: 1.65mm; Voltage Rating (DC): 200V; NexarPartId: 44386654; Packaging: Cut Tape; Max Operating Temperature: 175°C; Composition: Metal Film; RoHS: Compliant; Mount: Through Hole; Features: Flame Retardant Coating, Moisture Resistant; Number of Terminations: 2; Temperature Coefficient: 50ppm/°C; Min Operating Temperature: -55°C; Case/Package: Axial

## Sheet Temperature sensor iron.SchDoc
size A4; SheetNumber: 5; SheetTotal: 8
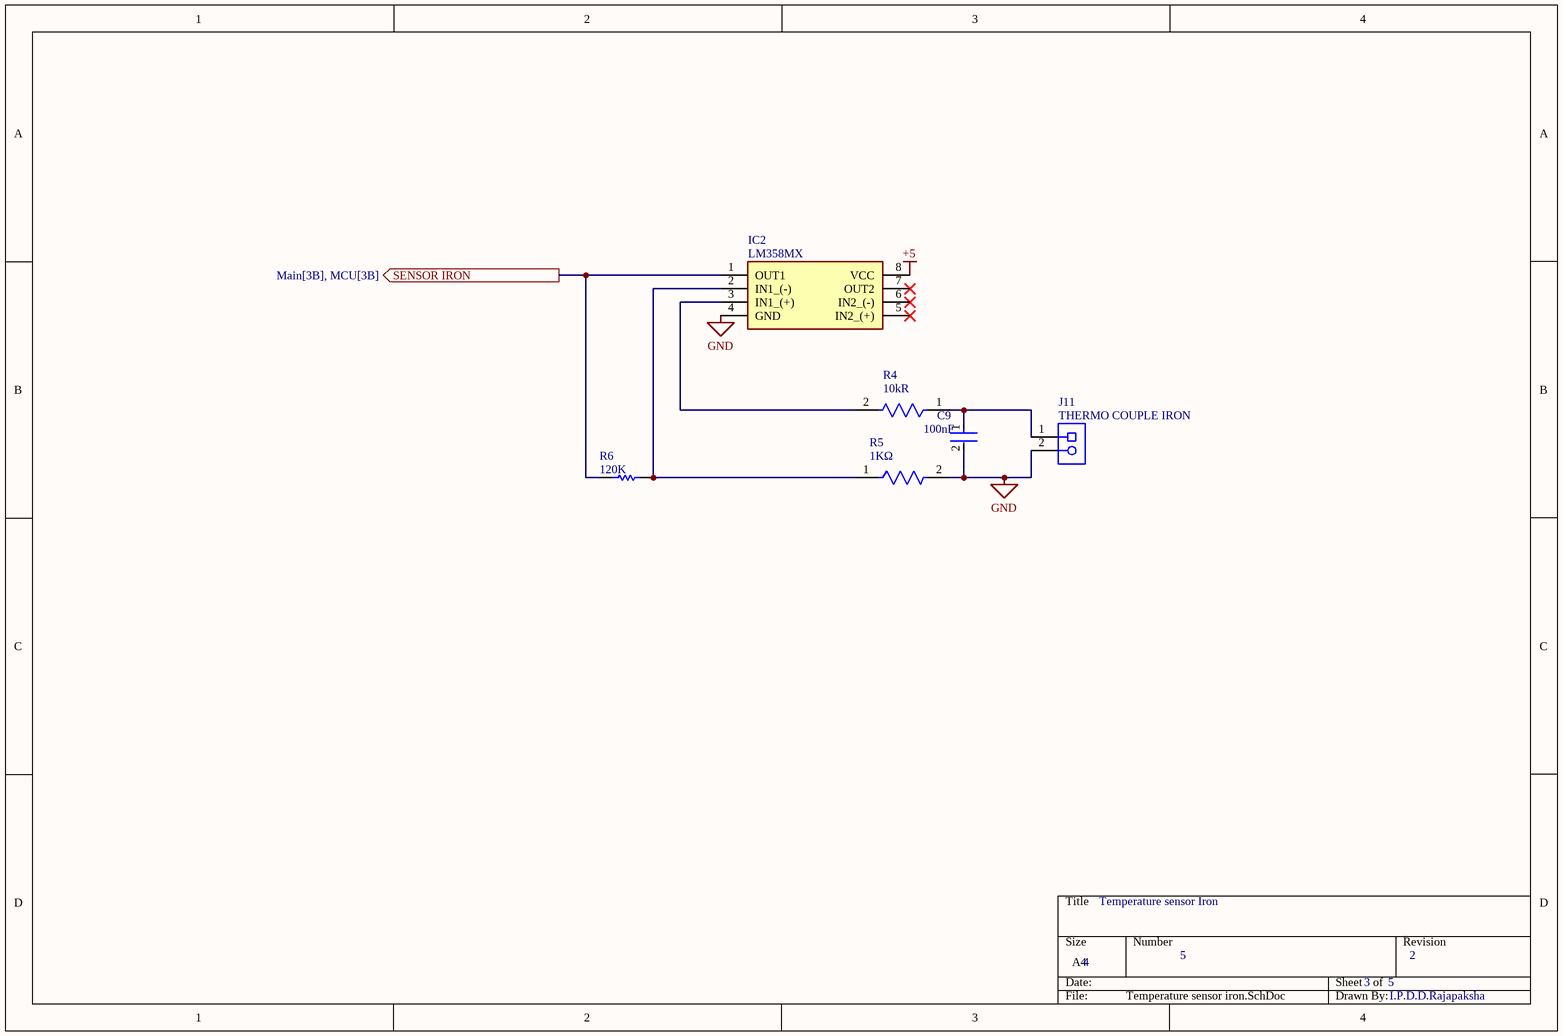
[diagram p4: Temperature sensor iron.SchDoc]

### Parts
C9  Capacitance: 100nF  [FP-0805-L_2_01_0_2-W_1_25-IPC_A]  (hidden comment: 0805YC104M4T2A)
IC2  LM358MX  [SOIC127P600X175-8N]
J11  Parameter 1: THERMO COUPLE IRON  [PHOE-1729128-2_V]  (hidden comment: 1729128)
R4  Resistance: 10kR  [FP-CRCW1206-e3-IPC_C]  (hidden comment: CRCW120610K0FKEA)
R5  value 1KΩ  [FP-CRGCQ1206-IPC_C]  (hidden comment: CRGCQ1206F1K0)
R6  Parameter 1: 120K  [RESC3216X60X45LL10T20]  (hidden comment: CRCW1206120KFKEA)

### Ports
SENSOR IRON (out, see Main[3B], MCU[3B])

### Nets
+5: IC2.8(VCC)
GND: C9.2 IC2.4(GND) J11.2 R5.2  [project net negative]
NetC9_1: C9.1 J11.1 R4.1
NetIC2_1: IC2.1(OUT1) R6.2 ; port SENSOR IRON
NetIC2_2: IC2.2(IN1_(-)) R5.1 R6.1
NetIC2_3: IC2.3(IN1_(+)) R4.2

Not connected (* = marked no-connect by the designer): IC2 5(IN2_(+))* 6(IN2_(-))* 7(OUT2)*

### Notes on the sheet
- Temperature sensor Iron
- 4
- 5
- 3      5
- 2
- I.P.D.D.Rajapaksha

### Library data of the parts
C9 = CMP-04427-015812-1: as C1 on sheet MCU; Termination: SMD/SMT; Case Code (Metric): 2012; Length: 0.079inch; Dielectric: X7R; Max Operating Temperature: 125°C; Thickness: 0.037inch; Ratings: AEC-Q200; Package Quantity: 4000; Weight: 0.000194oz; Voltage Rating: 16V; Voltage Rating (DC): 16V; Mount: Surface Mount; Width: 1.25mm; Packaging: Tape and Reel; Tolerance: 20%; Case/Package: 0805; Height: 0.94mm; Case Code (Imperial): 0805; Min Operating Temperature: -55°C
IC2 = LM358MX: Integrated Circuit; Manufacturer_Name: onsemi; Datasheet Link: http://www.onsemi.com/pub/Collateral/LM358A-D.pdf; Height: 1.75mm; Manufacturer_Part_Number: LM358MX; Mouser Part Number: 512-LM358MX; Mouser Price/Stock: https://www.mouser.co.uk/ProductDetail/onsemi-Fairchild/LM358MX?qs=k6rL%2Fc%252BPp3K5YsPvcEtWGQ%3D%3D; Arrow Part Number: LM358MX; Arrow Price/Stock: https://www.arrow.com/en/products/lm358mx/on-semiconductor
J11 = CMP-2000-05815-1: as J3 on sheet MCU; Manufacturer URL: http://www.phoenixcontact.com/; Datasheet URL: https://datasheet.ciiva.com/16046/1729128-16046181.pdf; RoHS: TRUE; Package URL: https://www.phoenixcontact.com/online/portal/pi/pxc/product_detail_page/!ut/p/b1/3VdJjqNKFDxLH8AFycySyWY2ozFsEPOMMQaDOX1XedGL_1Vdm5YXJleknhSKeBkvI6EA8ncAo3AYoDhBQGco6KN7VURTdemj9us_IEKEZo_YHiPAEWEFmDGOHMORkqKYCORBZxgL7ZoaZYcbFFUZ3fqxSY6GOuxydWUuHqz1ynmMFygu583Bob0Ewr6Sd_l-5m-kAueHiB0jpRwZwe58wwtkpxtMYd_LmGcDRU02dRNEyWt6Y2ti5pSyJ_reIkzIulrqApdnbT11V5jnCKbYNCvhEM1MCpPByat_X379-iThf08CI5GfOPqfBeS3BRoBOdD55AKVv0iLwCMq-2BrzXWSGRH7pUGD9uwXQjiph3xL0DKQwdGa0JImiIOmBNOestqgwTHSSs2oOep-78apyXQBvNi8ZLaFjvjWvcaUEBu0MC6Wbe-d6mB0FAebo2lUWinqYaZs5DAYzV0RP9yitUjnGJ0iI9xhZkT42OCQNUJJhkgWINNQLP2JFP6OpMg3JCVg70jqHT0lvKOnhHf0lPuOnnLf0VPuWx6_dxwUIvwk5WMkT0kLL1mh61l2yZVSzG3pYV_bqo-mj6uMKwKwdnnW8Jh5RTOJzMOA5c-eJDaZQw4mTMPH02PvS_ZAqNVjVTo2WyYLkwH_KU1mmmG5kjRhDqPXLwwVHvVOjCM60-fpXvTDfMGW1PVFVS1r4e4yVDk4ZdNbkUHvqPqQSeian4UD39fNKmachqdJ1NJbyk8rXT9mXTvPk3oE5meulKGgiruPJek-4I9hTT6G8ZLOyRSm2RRVbThERQad5OS28hdt4YW4vG0stgYYzsWsK4_7y6DZMjJSCqri1kyiZR5vD7pwIrNR7QwPHTcLTI5qT7eRlpHrdGiupYlqQDJ7zy_CND8fWWBoLRXxk1RVcXiBQwbTD4Xi7KL-FuO94t9xaqweXzH; PartNumber: 1729128; Package Description: 2-Pin Through Hole Device, Body 8.1 x 10.16 mm, Pitch 5.08 mm; Datasheet Version: 12/2013; Mounting Technology: ThroughHole; Orientation: Horizontal; Package Reference: 1729128-2; Packing: Bulk
R4 = CMP-2003-04807-2: as R1 on sheet MCU; Tolerance: 1%; Width: 0.063inch; Height: 0.55mm; Number of Pins: 2; Voltage Rating: 200V; Temperature Coefficient: 100ppm/°C; Military Standard: Not; Features: Automotive AEC-Q200; Depth: 1.6mm; Radiation Hardening: No; Termination: SMD/SMT; Case Code (Imperial): 1206; Weight: 0.000353oz; Length: 3.2mm; Package Quantity: 10; Voltage Rating (DC): 200V; Case/Package: 1206; Min Operating Temperature: -55°C; Number of Terminations: 2; Composition: Thick Film; Contact Plating: Tin; Power Rating: 250mW; Packaging: Tape and Reel; Max Operating Temperature: 155°C; Lead Free: Lead Free; Case Code (Metric): 3216
R5 = CMP-03211-006592-1: CRGCQ1206 1KΩ 0.25W 1% ±100ppm/°C 200V; Manufacturer: TE Connectivity; Automotive Grade: Grade 685; Tolerance: 0.01; Ipc Land Pattern Name: RESC310155X55; Temperature Range Low: -55°C; Device Class L3: Chip SMD Resistors; ComponentLink2URL: https://www.te.com/commerce/DocumentDelivery/DDEController?Action=showdoc&DocId=Data+Sheet%7F1773204-3%7F1%7Fpdf%7FEnglish%7FENG_DS_1773204-3_1.pdf%7F4-2176347-694; Automotive: Yes; Temperature: -55°C to +155°C; Manufacturer Part Number: CRGCQ1206F1K0; Package: CRGCQ1206; Octopart: https://octopart.com/crgcq1206f1k0-te+connectivity-91018258; Device Class L1: Passive Components; Series: CRGCQ; Device Class L2: Resistors; RoHS: TRUE; Lead Free: Yes; ComponentLink2Description: Datasheet; Power Rating: 0.25W; Temperature Coefficient: ±100ppm/°C; Voltage Rating: 200V; Temperature Range High: +155°C; Height: 0.65mm; Category: Res; Resistance: 1KΩ; Composition: Thick Film; Ambient Temperature Range High: +70°C
R6 = CMP-2003-04836-1: Manufacturer: Vishay Dale; Part Number: CRCW1206120KFKEA

## Sheet AC  circuit.SchDoc
size A4; SheetNumber: 6; SheetTotal: 8
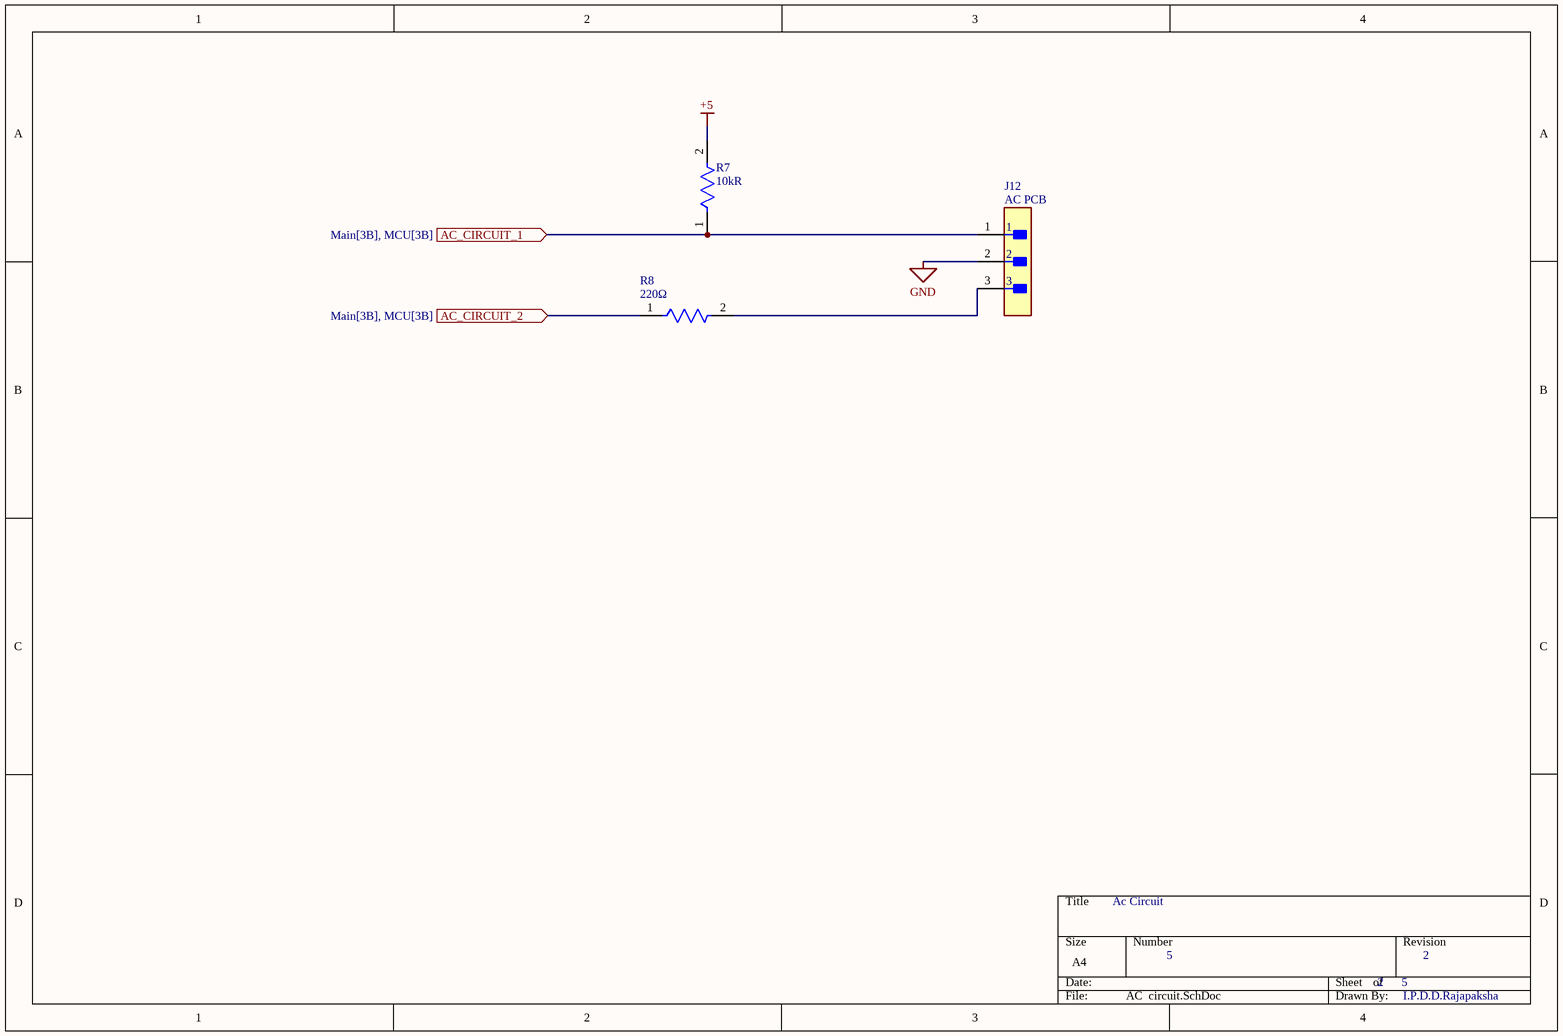
[diagram p5: AC  circuit.SchDoc]

### Parts
J12  Parameter 1: AC PCB  [FP-B3B-XH-A_LF_SN-MFG]  (hidden comment: B3B-XH-A(LF)(SN))
R7  Resistance: 10kR  [FP-CRCW1206-e3-IPC_C]  (hidden comment: CRCW120610K0FKEA)
R8  value 220Ω  [FP-AC1206-MFG]  (hidden comment: AC1206FR-07220RL)

### Ports
AC_CIRCUIT_1 (in, see Main[3B], MCU[3B]), AC_CIRCUIT_2 (in, see Main[3B], MCU[3B])

### Nets
+5: R7.2
GND: J12.2  [project net negative]
NetJ12_1: J12.1 R7.1 ; port AC_CIRCUIT_1
NetJ12_3: J12.3 R8.2
NetR8_1: R8.1 ; port AC_CIRCUIT_2

### Notes on the sheet
- Ac Circuit
- 5
- 2      5
- 2
- I.P.D.D.Rajapaksha

### Library data of the parts
J12 = CMP-17439-000014-3: CONN HEADER VERT 3POS 2.5MM; Max Voltage Rating (DC): 250V; Number of Positions: 3; Current Rating: 3A; Gender: Male; Wire/Cable Gauge: 22AWG; Contact Resistance: 20mR; Insulation Resistance: 1GR; AC PCB: POT; Insulation Material: Nylon; Contact Plating: Tin; Depth: 5.75mm; Contact Type: Male Pin; Max Operating Temperature: 85°C; Insulation Color: Natural; Voltage Rating (AC): 250V; Color: Natural; Connector Type: Header; Orientation: Straight; Fastening Type: Detent; Housing Color: White; Min Operating Temperature: -25°C; Termination: Solder; Voltage Rating: 250V; Series: XH; Pitch: 2.5mm; Contact Shape: Square; Number of Rows: 1; Lead Free: Lead Free; Packaging: Bulk; Mount: Through Hole; Flammability Rating: UL94 V-0; Max Voltage Rating (AC): 250V; REACH SVHC: No SVHC; Housing Material: Polyamide; Contact Material: Brass; Lead Pitch: 2.5mm; Contact Finish - Mating: TIN; Length: 9.9mm; Max Current Rating: 3A; Number of Contacts: 3
R7 = CMP-2003-04807-2: as R1 on sheet MCU; Tolerance: 1%; Width: 0.063inch; Height: 0.55mm; Number of Pins: 2; Voltage Rating: 200V; Temperature Coefficient: 100ppm/°C; Military Standard: Not; Features: Automotive AEC-Q200; Depth: 1.6mm; Radiation Hardening: No; Termination: SMD/SMT; Case Code (Imperial): 1206; Weight: 0.000353oz; Length: 3.2mm; Package Quantity: 10; Voltage Rating (DC): 200V; Case/Package: 1206; Min Operating Temperature: -55°C; Number of Terminations: 2; Composition: Thick Film; Contact Plating: Tin; Power Rating: 250mW; Packaging: Tape and Reel; Max Operating Temperature: 155°C; Lead Free: Lead Free; Case Code (Metric): 3216
R8 = CMP-03412-034136-1: RES SMD 220 OHM 1% 1/4W 1206; Manufacturer: Yageo; Power Rating: 0.25W; Tolerance: 0.01; Automotive Grade: Grade 0; Voltage Rating: 200V; Package: AC1206; Series: AC; Device Class L1: Passive Components; Manufacturer Part Number: AC1206FR-07220RL; Ipc Land Pattern Name: RESC310160X55; Temperature Range Low: -55°C; Temperature Range High: +155°C; Category: Res; Digikey Description: RES SMD 220 OHM 1% 1/4W 1206; ComponentLink2URL: http://www.yageo.com/NewPortal/yageodocoutput?fileName=/pdf/R-Chip/PYu-AC_51_RoHS_L_6.pdf; Device Class L2: Resistors; Mouser Description: Thick Film Resistors - SMD 1/4W 220ohm 1% AEC-Q200; Octopart: https://octopart.com/ac1206fr-07220rl-yageo-30511077; Composition: Thick Film; Height: 0.65mm; Automotive: Yes; Device Class L3: Chip SMD Resistors; Lead Free: Yes; Temperature: -55°C to +155°C; RoHS: TRUE; Resistance: 220Ω; ComponentLink2Description: Datasheet; Footprint Url: http://www.yageo.com/exep/pages/download/literatures/PYu-R_Mount_10.pdf

## Sheet Fan control hot air.SchDoc
size A4; SheetNumber: 7; SheetTotal: 8
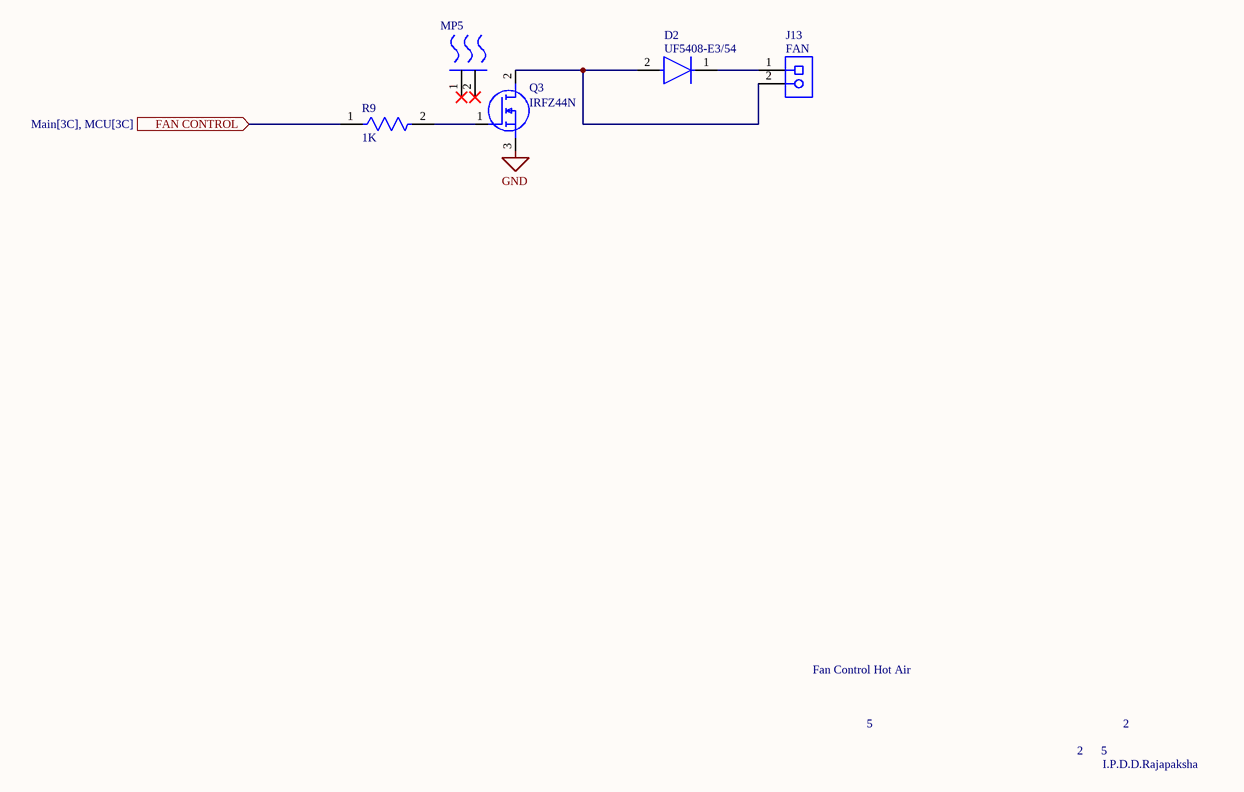
[diagram p6: Fan control hot air.SchDoc]

### Parts
D2  UF5408-E3/54  [FP-UF5408-E3-54-MFG]
J13  Parameter 1: FAN  [PHOE-1729128-2_V]  (hidden comment: 1729128)
MP5  WV-T264-101E  [FP-WV-T264-101E-MFG]  (value not drawn)
Q3  IRFZ44N  [TO254P440X1000X1900-3P]
R9  value 1K  [FP-CMF50-0]  (hidden comment: CMF5073K200FHEB)

### Ports
FAN CONTROL (in, see Main[3C], MCU[3C])

### Nets
GND: Q3.3(S)  [project net negative]
NetD2_1: D2.1(C) J13.1
NetD2_2: D2.2(A) J13.2 Q3.2(D)
NetQ3_1: Q3.1(G) R9.2
NetR9_1: R9.1 ; port FAN CONTROL

Not connected (* = marked no-connect by the designer): MP5 1(MNT_1)* 2(MNT_2)*

### Notes on the sheet
- Fan Control Hot Air
- 5
- 2      5
- 2
- I.P.D.D.Rajapaksha

### Library data of the parts
D2 = CMP-02540-000083-1: DIODE GEN PURP 1KV 3A DO201AD; Capacitance: 36pF; Recovery Time: 75ns; Max Reverse Current: 10uA; Outside Diameter: 5.3mm; Forward Voltage: 1.7V; Peak Non-Repetitive Surge Current: 150A; Element Configuration: Single; Polarity: Standard; Average Rectified Current: 3A; Width: 5.3mm; Mount: Through Hole; Number of Pins: 2; Case/Package: DO-201AD; Series: -; Max Repetitive Reverse Voltage (Vrrm): 1kV; Packaging: Tape and Reel; Max Surge Current: 150A; Length: 9.5mm; Lead Free: Lead Free; Termination: Axial; Reverse Recovery Time-Max: 75ns; Max Operating Temperature: 150°C; Height: 5.3mm; Forward Current: 3A; Radiation Hardening: No; RoHS Compliant: Yes; Min Operating Temperature: -55°C; Output Current: 3A; Reverse Voltage: 1kV; Reverse Recovery Time: 75ns; Max Forward Surge Current (Ifsm): 150A; Package Quantity: 1; Max Reverse Voltage (DC): 1kV
J13 = CMP-2000-05815-1: as J3 on sheet MCU; Manufacturer URL: http://www.phoenixcontact.com/; Datasheet URL: https://datasheet.ciiva.com/16046/1729128-16046181.pdf; RoHS: TRUE; Package URL: https://www.phoenixcontact.com/online/portal/pi/pxc/product_detail_page/!ut/p/b1/3VdJjqNKFDxLH8AFycySyWY2ozFsEPOMMQaDOX1XedGL_1Vdm5YXJleknhSKeBkvI6EA8ncAo3AYoDhBQGco6KN7VURTdemj9us_IEKEZo_YHiPAEWEFmDGOHMORkqKYCORBZxgL7ZoaZYcbFFUZ3fqxSY6GOuxydWUuHqz1ynmMFygu583Bob0Ewr6Sd_l-5m-kAueHiB0jpRwZwe58wwtkpxtMYd_LmGcDRU02dRNEyWt6Y2ti5pSyJ_reIkzIulrqApdnbT11V5jnCKbYNCvhEM1MCpPByat_X379-iThf08CI5GfOPqfBeS3BRoBOdD55AKVv0iLwCMq-2BrzXWSGRH7pUGD9uwXQjiph3xL0DKQwdGa0JImiIOmBNOestqgwTHSSs2oOep-78apyXQBvNi8ZLaFjvjWvcaUEBu0MC6Wbe-d6mB0FAebo2lUWinqYaZs5DAYzV0RP9yitUjnGJ0iI9xhZkT42OCQNUJJhkgWINNQLP2JFP6OpMg3JCVg70jqHT0lvKOnhHf0lPuOnnLf0VPuWx6_dxwUIvwk5WMkT0kLL1mh61l2yZVSzG3pYV_bqo-mj6uMKwKwdnnW8Jh5RTOJzMOA5c-eJDaZQw4mTMPH02PvS_ZAqNVjVTo2WyYLkwH_KU1mmmG5kjRhDqPXLwwVHvVOjCM60-fpXvTDfMGW1PVFVS1r4e4yVDk4ZdNbkUHvqPqQSeian4UD39fNKmachqdJ1NJbyk8rXT9mXTvPk3oE5meulKGgiruPJek-4I9hTT6G8ZLOyRSm2RRVbThERQad5OS28hdt4YW4vG0stgYYzsWsK4_7y6DZMjJSCqri1kyiZR5vD7pwIrNR7QwPHTcLTI5qT7eRlpHrdGiupYlqQDJ7zy_CND8fWWBoLRXxk1RVcXiBQwbTD4Xi7KL-FuO94t9xaqweXzH; PartNumber: 1729128; Package Description: 2-Pin Through Hole Device, Body 8.1 x 10.16 mm, Pitch 5.08 mm; Datasheet Version: 12/2013; Mounting Technology: ThroughHole; Orientation: Horizontal; Package Reference: 1729128-2; Packing: Bulk
MP5 = CMP-33535-000032-1: as MP1 on sheet Power Circuit; Width: 23.4mm; Weight: 0.42oz; Package Quantity: 10; RoHS Compliant: Yes; Mount: Clip; Package Cooled: TO-264; Height Off Base: 0.63inch; Height: 32mm; Packaging: Bulk; Series: W; Case/Package: TO-264; Length: 1.26inch; Material: Aluminium
Q3 = IRFZ44N: MOSFET (N-Channel); Manufacturer_Name: Inchange Semiconductor; Datasheet Link: https://4donline.ihs.com/images/VipMasterIC/IC/INSE/INSES02201/INSES02201-1.pdf?hkey=EF798316E3902B6ED9A73243A3159BB0; Height: 4.4mm; Manufacturer_Part_Number: IRFZ44N
R9 = CMP-00030-44386654-1: as R2 on sheet Current control iron; Tolerance: 1%; Width: 1.65mm; Length: 3.81mm; Schedule B: 8533210090, 8533210090; Termination: Axial; Lead Free: Lead Free; Diameter: 1.65mm; Voltage Rating (DC): 200V; NexarPartId: 44386654; Packaging: Cut Tape; Max Operating Temperature: 175°C; Composition: Metal Film; RoHS: Compliant; Mount: Through Hole; Features: Flame Retardant Coating, Moisture Resistant; Number of Terminations: 2; Temperature Coefficient: 50ppm/°C; Min Operating Temperature: -55°C; Case/Package: Axial

## Sheet Tem sensor hot air.SchDoc
size A4; SheetNumber: 8; SheetTotal: 8
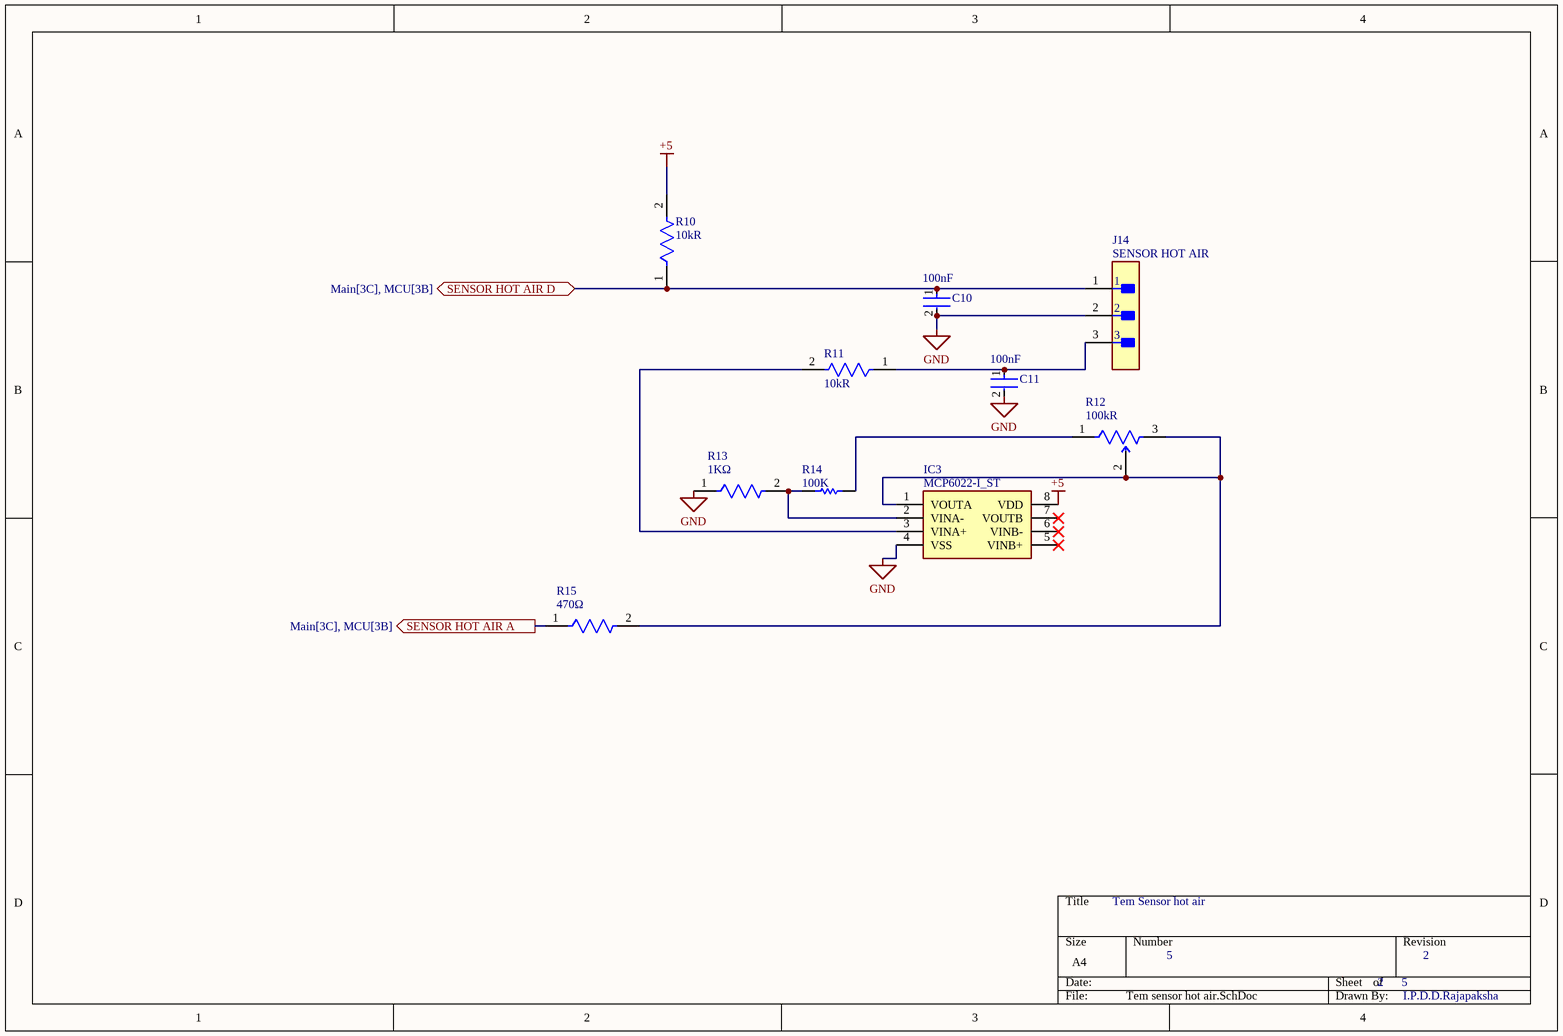
[diagram p7: Tem sensor hot air.SchDoc]

### Parts
C10  Capacitance: 100nF  [FP-0805-L_2_01_0_2-W_1_25-IPC_A]  (hidden comment: 0805YC104M4T2A)
C11  Capacitance: 100nF  [FP-0805-L_2_01_0_2-W_1_25-IPC_A]  (hidden comment: 0805YC104M4T2A)
IC3  MCP6022-I_ST  [SOP65P640X120-8N]
J14  Parameter 1: SENSOR HOT AIR  [FP-B3B-XH-A_LF_SN-MFG]  (hidden comment: B3B-XH-A(LF)(SN))
R10  Resistance: 10kR  [FP-CRCW1206-e3-IPC_C]  (hidden comment: CRCW120610K0FKEA)
R11  Resistance: 10kR  [FP-CRCW1206-e3-IPC_C]  (hidden comment: CRCW120610K0FKEA)
R12  Resistance: 100kR  [FP-67W-MFG]  (hidden comment: 67WR100KLF)
R13  value 1KΩ  [FP-CRGCQ1206-IPC_C]  (hidden comment: CRGCQ1206F1K0)
R14  Parameter 1: 100K  [RESC3216X60X45NL10T20]  (hidden comment: CRCW1206100KFKEA)
R15  value 470Ω  [FP-CRGCQ1206-IPC_C]  (hidden comment: CRGCQ1206F470R)

### Ports
SENSOR HOT AIR A (out, see Main[3C], MCU[3B]), SENSOR HOT AIR D (bidir, see Main[3C], MCU[3B])

### Nets
+5: IC3.8(VDD) R10.2
GND: C10.2 C11.2 IC3.4(VSS) J14.2 R13.1  [project net negative]
NetC10_1: C10.1 J14.1 R10.1 ; port SENSOR HOT AIR D
NetC11_1: C11.1 J14.3 R11.1
NetIC3_1: IC3.1(VOUTA) R12.2 R12.3 R15.2
NetIC3_2: IC3.2(VINA-) R13.2 R14.1
NetIC3_3: IC3.3(VINA+) R11.2
NetR12_1: R12.1 R14.2
NetR15_1: R15.1 ; port SENSOR HOT AIR A

Not connected (* = marked no-connect by the designer): IC3 5(VINB+)* 6(VINB-)* 7(VOUTB)*

### Notes on the sheet
- Tem Sensor hot air
- 5
- 2      5
- 2
- I.P.D.D.Rajapaksha

### Library data of the parts
C10 C11 = CMP-04427-015812-1: as C1 on sheet MCU; Termination: SMD/SMT; Case Code (Metric): 2012; Length: 0.079inch; Dielectric: X7R; Max Operating Temperature: 125°C; Thickness: 0.037inch; Ratings: AEC-Q200; Package Quantity: 4000; Weight: 0.000194oz; Voltage Rating: 16V; Voltage Rating (DC): 16V; Mount: Surface Mount; Width: 1.25mm; Packaging: Tape and Reel; Tolerance: 20%; Case/Package: 0805; Height: 0.94mm; Case Code (Imperial): 0805; Min Operating Temperature: -55°C
IC3 = MCP6022-I_ST: Integrated Circuit; Manufacturer_Name: Microchip; Manufacturer_Part_Number: MCP6022-I/ST; Datasheet Link: https://datasheet.datasheetarchive.com/originals/distributors/Datasheets-DGA24/1612719.pdf; Height: 1.2mm; Mouser Part Number: 579-MCP6022-I/ST; Mouser Price/Stock: https://www.mouser.co.uk/ProductDetail/Microchip-Technology/MCP6022-I-ST?qs=cQYLKLPzRJmFw784uzHvww%3D%3D; Arrow Part Number: MCP6022-I/ST; Arrow Price/Stock: https://www.arrow.com/en/products/mcp6022-ist/microchip-technology?region=europe
J14 = CMP-17439-000014-3: as J12 on sheet AC  circuit; Insulation Material: Nylon; Contact Plating: Tin; Depth: 5.75mm; Contact Type: Male Pin; Max Operating Temperature: 85°C; Insulation Color: Natural; Voltage Rating (AC): 250V; Color: Natural; Connector Type: Header; Orientation: Straight; Fastening Type: Detent; Housing Color: White; Min Operating Temperature: -25°C; Termination: Solder; Voltage Rating: 250V; Series: XH; Pitch: 2.5mm; Contact Shape: Square; Number of Rows: 1; Lead Free: Lead Free; Packaging: Bulk; Mount: Through Hole; Flammability Rating: UL94 V-0; Max Voltage Rating (AC): 250V; REACH SVHC: No SVHC; Housing Material: Polyamide; Contact Material: Brass; Lead Pitch: 2.5mm; Contact Finish - Mating: TIN; Length: 9.9mm; Max Current Rating: 3A; Number of Contacts: 3
R10 R11 = CMP-2003-04807-2: as R1 on sheet MCU; Tolerance: 1%; Width: 0.063inch; Height: 0.55mm; Number of Pins: 2; Voltage Rating: 200V; Temperature Coefficient: 100ppm/°C; Military Standard: Not; Features: Automotive AEC-Q200; Depth: 1.6mm; Radiation Hardening: No; Termination: SMD/SMT; Case Code (Imperial): 1206; Weight: 0.000353oz; Length: 3.2mm; Package Quantity: 10; Voltage Rating (DC): 200V; Case/Package: 1206; Min Operating Temperature: -55°C; Number of Terminations: 2; Composition: Thick Film; Contact Plating: Tin; Power Rating: 250mW; Packaging: Tape and Reel; Max Operating Temperature: 155°C; Lead Free: Lead Free; Case Code (Metric): 3216
R12 = CMP-50449-000002-1: TRIMMER 100K OHM 0.5W PC PIN TOP; Power Rating: 500mW; Temperature Coefficient: 100ppm/°C; Number of Turns: 20; Voltage Rating: 200V; Tolerance: 10%; Radiation Hardening: No; Min Operating Temperature: -55°C; Packaging: Bulk; Depth: 4.95mm; Resistor Type: Cermet; Mount: Through Hole; Max Power Dissipation: 500mW; Package Quantity: 100; Length: 9.53mm; REACH SVHC: No SVHC; Voltage Rating (DC): 200V; Series: 67; Height: 0.409inch; Type: Potentiometer; Weight: 1.1g; RoHS Compliant: Yes; Technology: CERMET; Lead Free: Lead Free; Termination: Pin; Resistance Tolerance: 10%; Max Operating Temperature: 125°C; Military Standard: Not
R13 = CMP-03211-006592-1: as R5 on sheet Temperature sensor iron; Ipc Land Pattern Name: RESC310155X55; Temperature Range Low: -55°C; Device Class L3: Chip SMD Resistors; ComponentLink2URL: https://www.te.com/commerce/DocumentDelivery/DDEController?Action=showdoc&DocId=Data+Sheet%7F1773204-3%7F1%7Fpdf%7FEnglish%7FENG_DS_1773204-3_1.pdf%7F4-2176347-694; Automotive: Yes; Temperature: -55°C to +155°C; Manufacturer Part Number: CRGCQ1206F1K0; Package: CRGCQ1206; Octopart: https://octopart.com/crgcq1206f1k0-te+connectivity-91018258; Device Class L1: Passive Components; Series: CRGCQ; Device Class L2: Resistors; RoHS: TRUE; Lead Free: Yes; ComponentLink2Description: Datasheet; Power Rating: 0.25W; Temperature Coefficient: ±100ppm/°C; Voltage Rating: 200V; Temperature Range High: +155°C; Height: 0.65mm; Category: Res; Resistance: 1KΩ; Composition: Thick Film; Ambient Temperature Range High: +70°C
R14 = CMP-1014-00736-2: Manufacturer: Vishay Dale; Part Number: CRCW1206100KFKEA
R15 = CMP-03211-011147-1: CRGCQ 1206 470R 1%; Manufacturer: TE Connectivity; Power Rating: 0.25W; Tolerance: 0.01; Automotive Grade: Grade 609; Voltage Rating: 200V; Temperature Coefficient: ±100ppm/°C; Octopart: https://octopart.com/crgcq1206f470r-te+connectivity-91018284; Manufacturer Part Number: CRGCQ1206F470R; ComponentLink2Description: Datasheet; Device Class L3: Chip SMD Resistors; Temperature Range High: +155°C; Device Class L1: Passive Components; Ipc Land Pattern Name: RESC310155X55; Ambient Temperature Range High: +70°C; RoHS: TRUE; Series: CRGCQ; Height: 0.65mm; Digikey Description: CRGCQ 1206 470R 1%; Package: CRGCQ1206; Composition: Thick Film; Lead Free: Yes; Resistance: 470Ω; Automotive: Yes; Category: Res; Temperature Range Low: -55°C; ComponentLink2URL: https://www.te.com/commerce/DocumentDelivery/DDEController?Action=showdoc&DocId=Data+Sheet%7F1773204-3%7F1%7Fpdf%7FEnglish%7FENG_DS_1773204-3_1.pdf%7F4-2176347-618; Device Class L2: Resistors; Temperature: -55°C to +155°C; Mouser Description: Res General Purpose Thick Film 1206 470 Ohm 1% 1/4W ±100ppm/°C Molded Paper T/R

## Nets that join several sheets
+5: MCU (9 pins), Temperature sensor iron (IC2.8), AC  circuit (R7.2), Tem sensor hot air (IC3.8 R10.2)
negative: MCU (14 pins), Power Circuit (10 pins), Current control iron (Q2.3 R3.2), Temperature sensor iron (C9.2 IC2.4 J11.2 R5.2), AC  circuit (J12.2), Fan control hot air (Q3.3), Tem sensor hot air (5 pins)
NetC10_1: MCU (U1.2), Tem sensor hot air (C10.1 J14.1 R10.1)
NetIC2_1: MCU (U1.23), Temperature sensor iron (IC2.1 R6.2)
NetJ12_1: MCU (U1.4), AC  circuit (J12.1 R7.1)
NetR2_2: MCU (U1.16), Current control iron (R2.2)
NetR8_1: MCU (U1.13), AC  circuit (R8.1)
NetR9_1: MCU (U1.15), Fan control hot air (R9.1)
NetR15_1: MCU (U1.24), Tem sensor hot air (R15.1)